# EasyEDA Pro project firefly_rp2354A.eprj, board PCB1
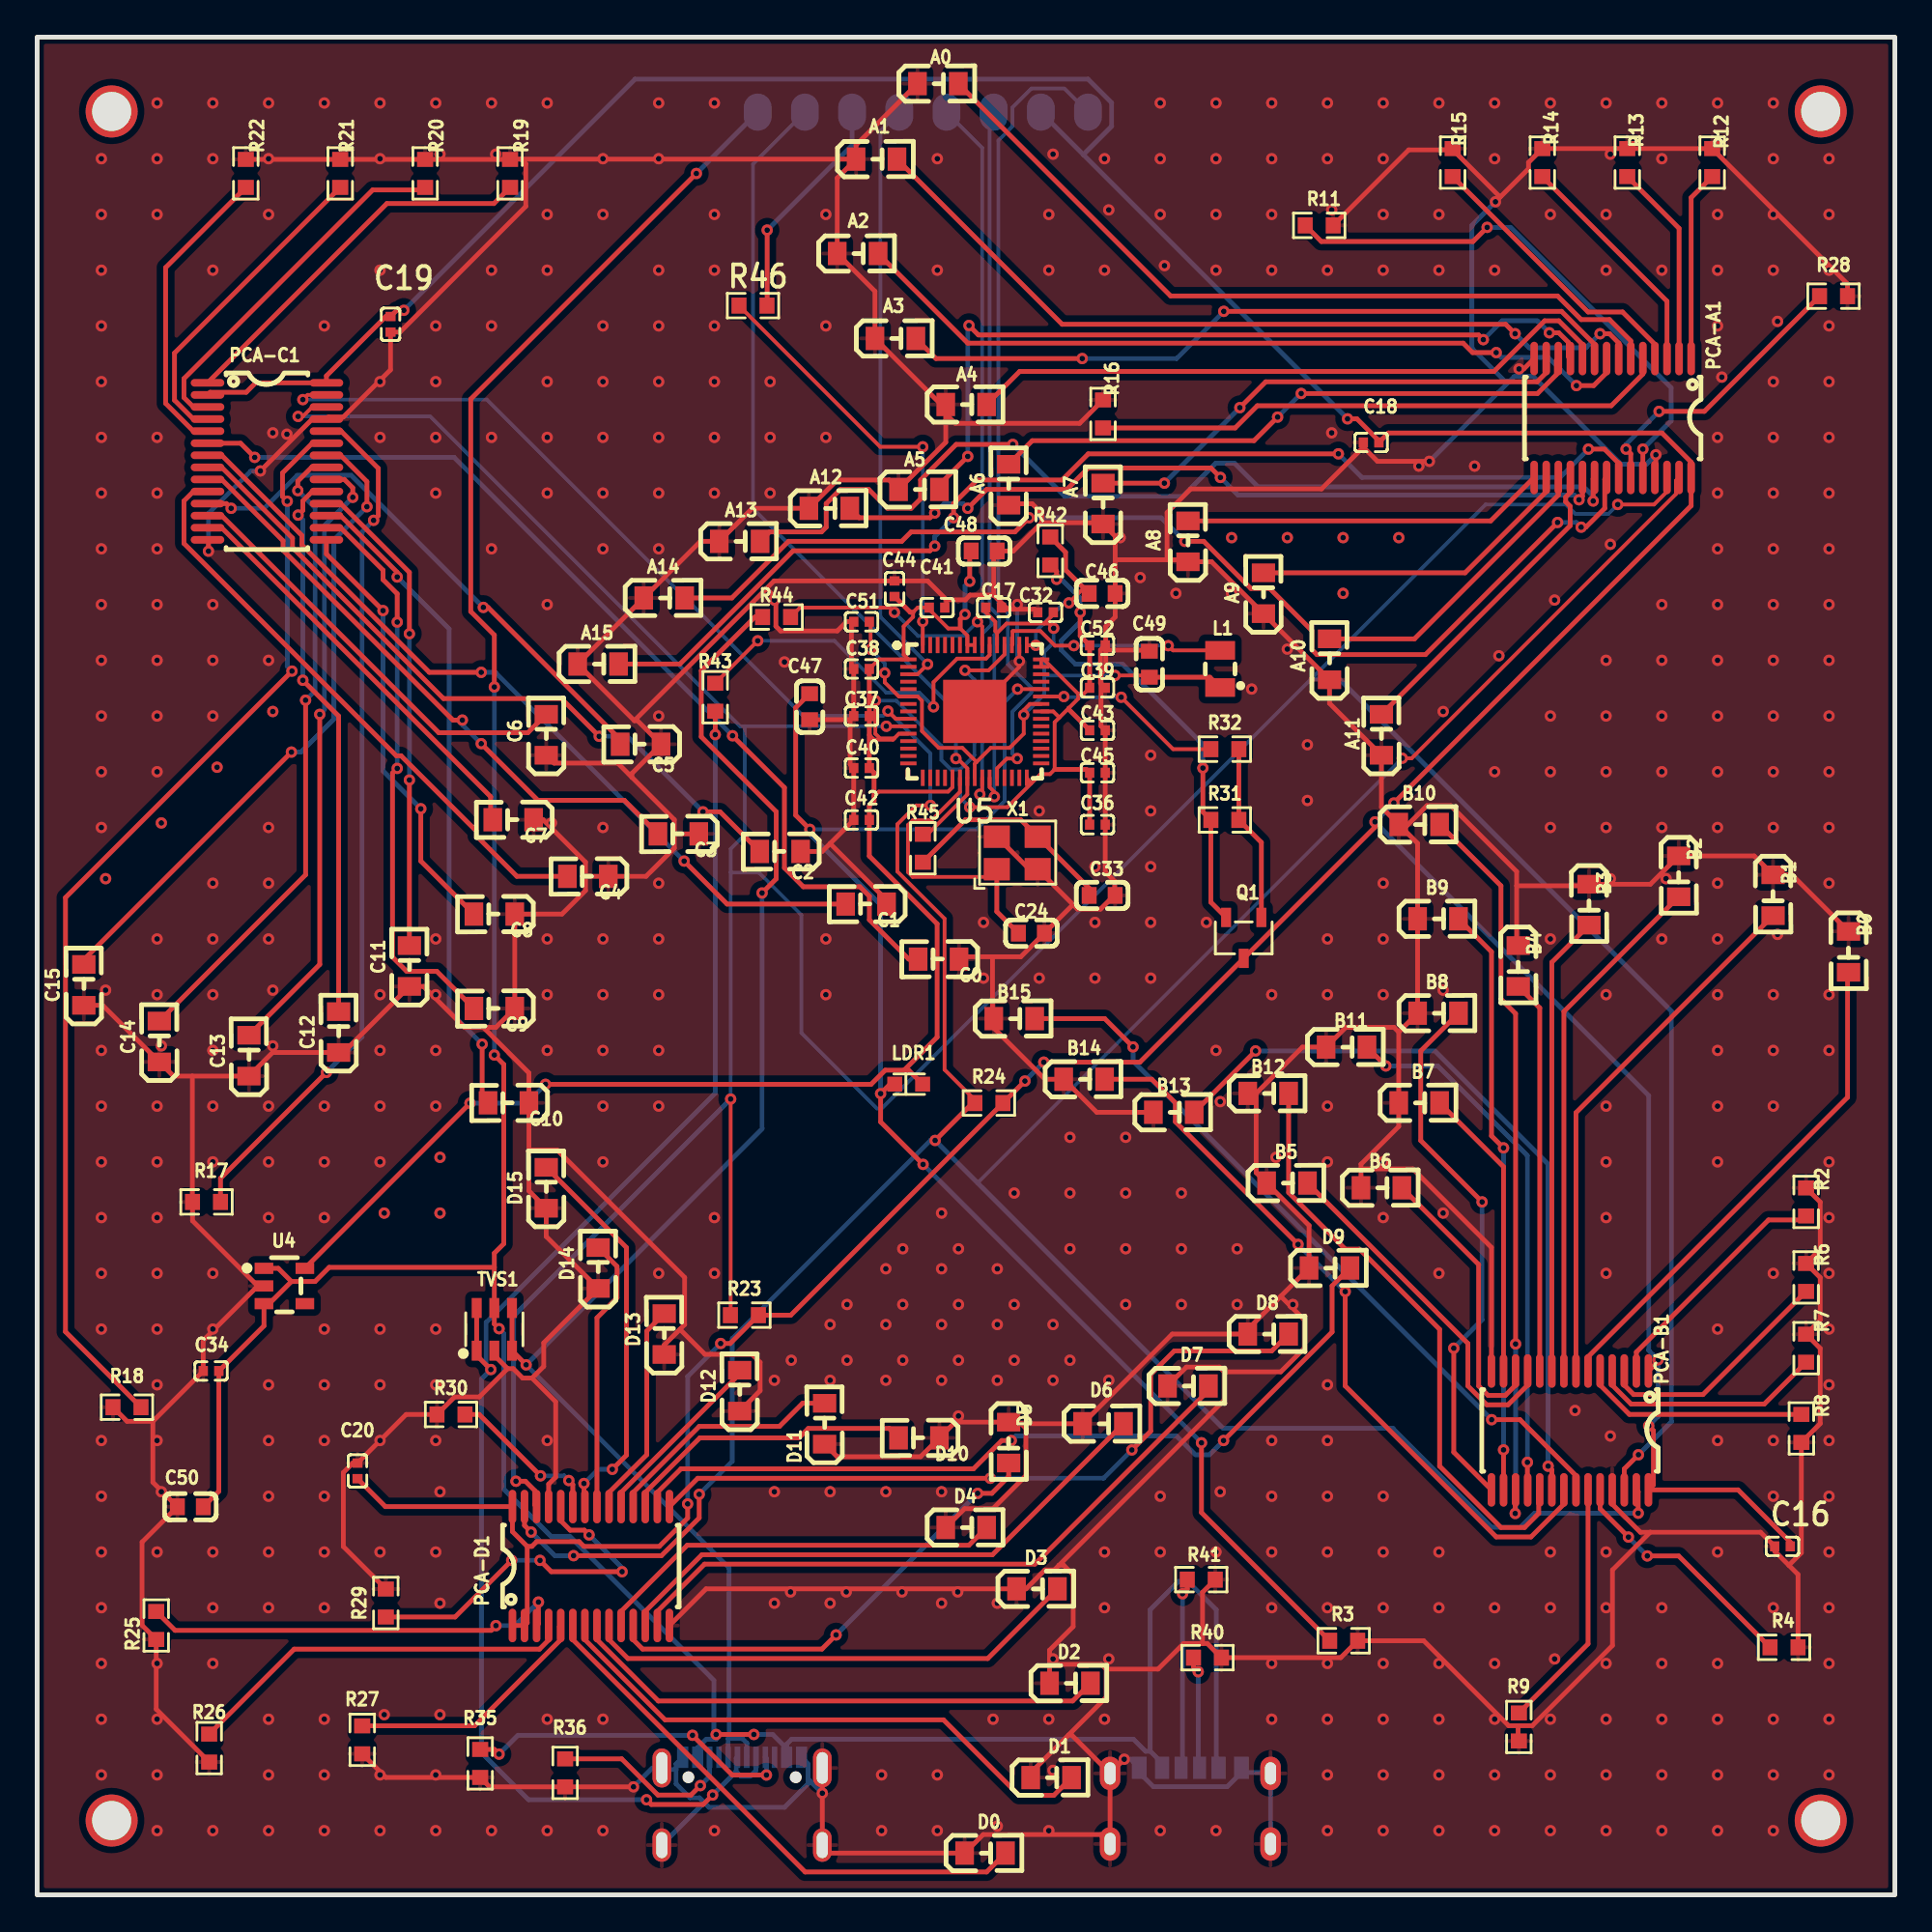
[diagram p2: board, top side]
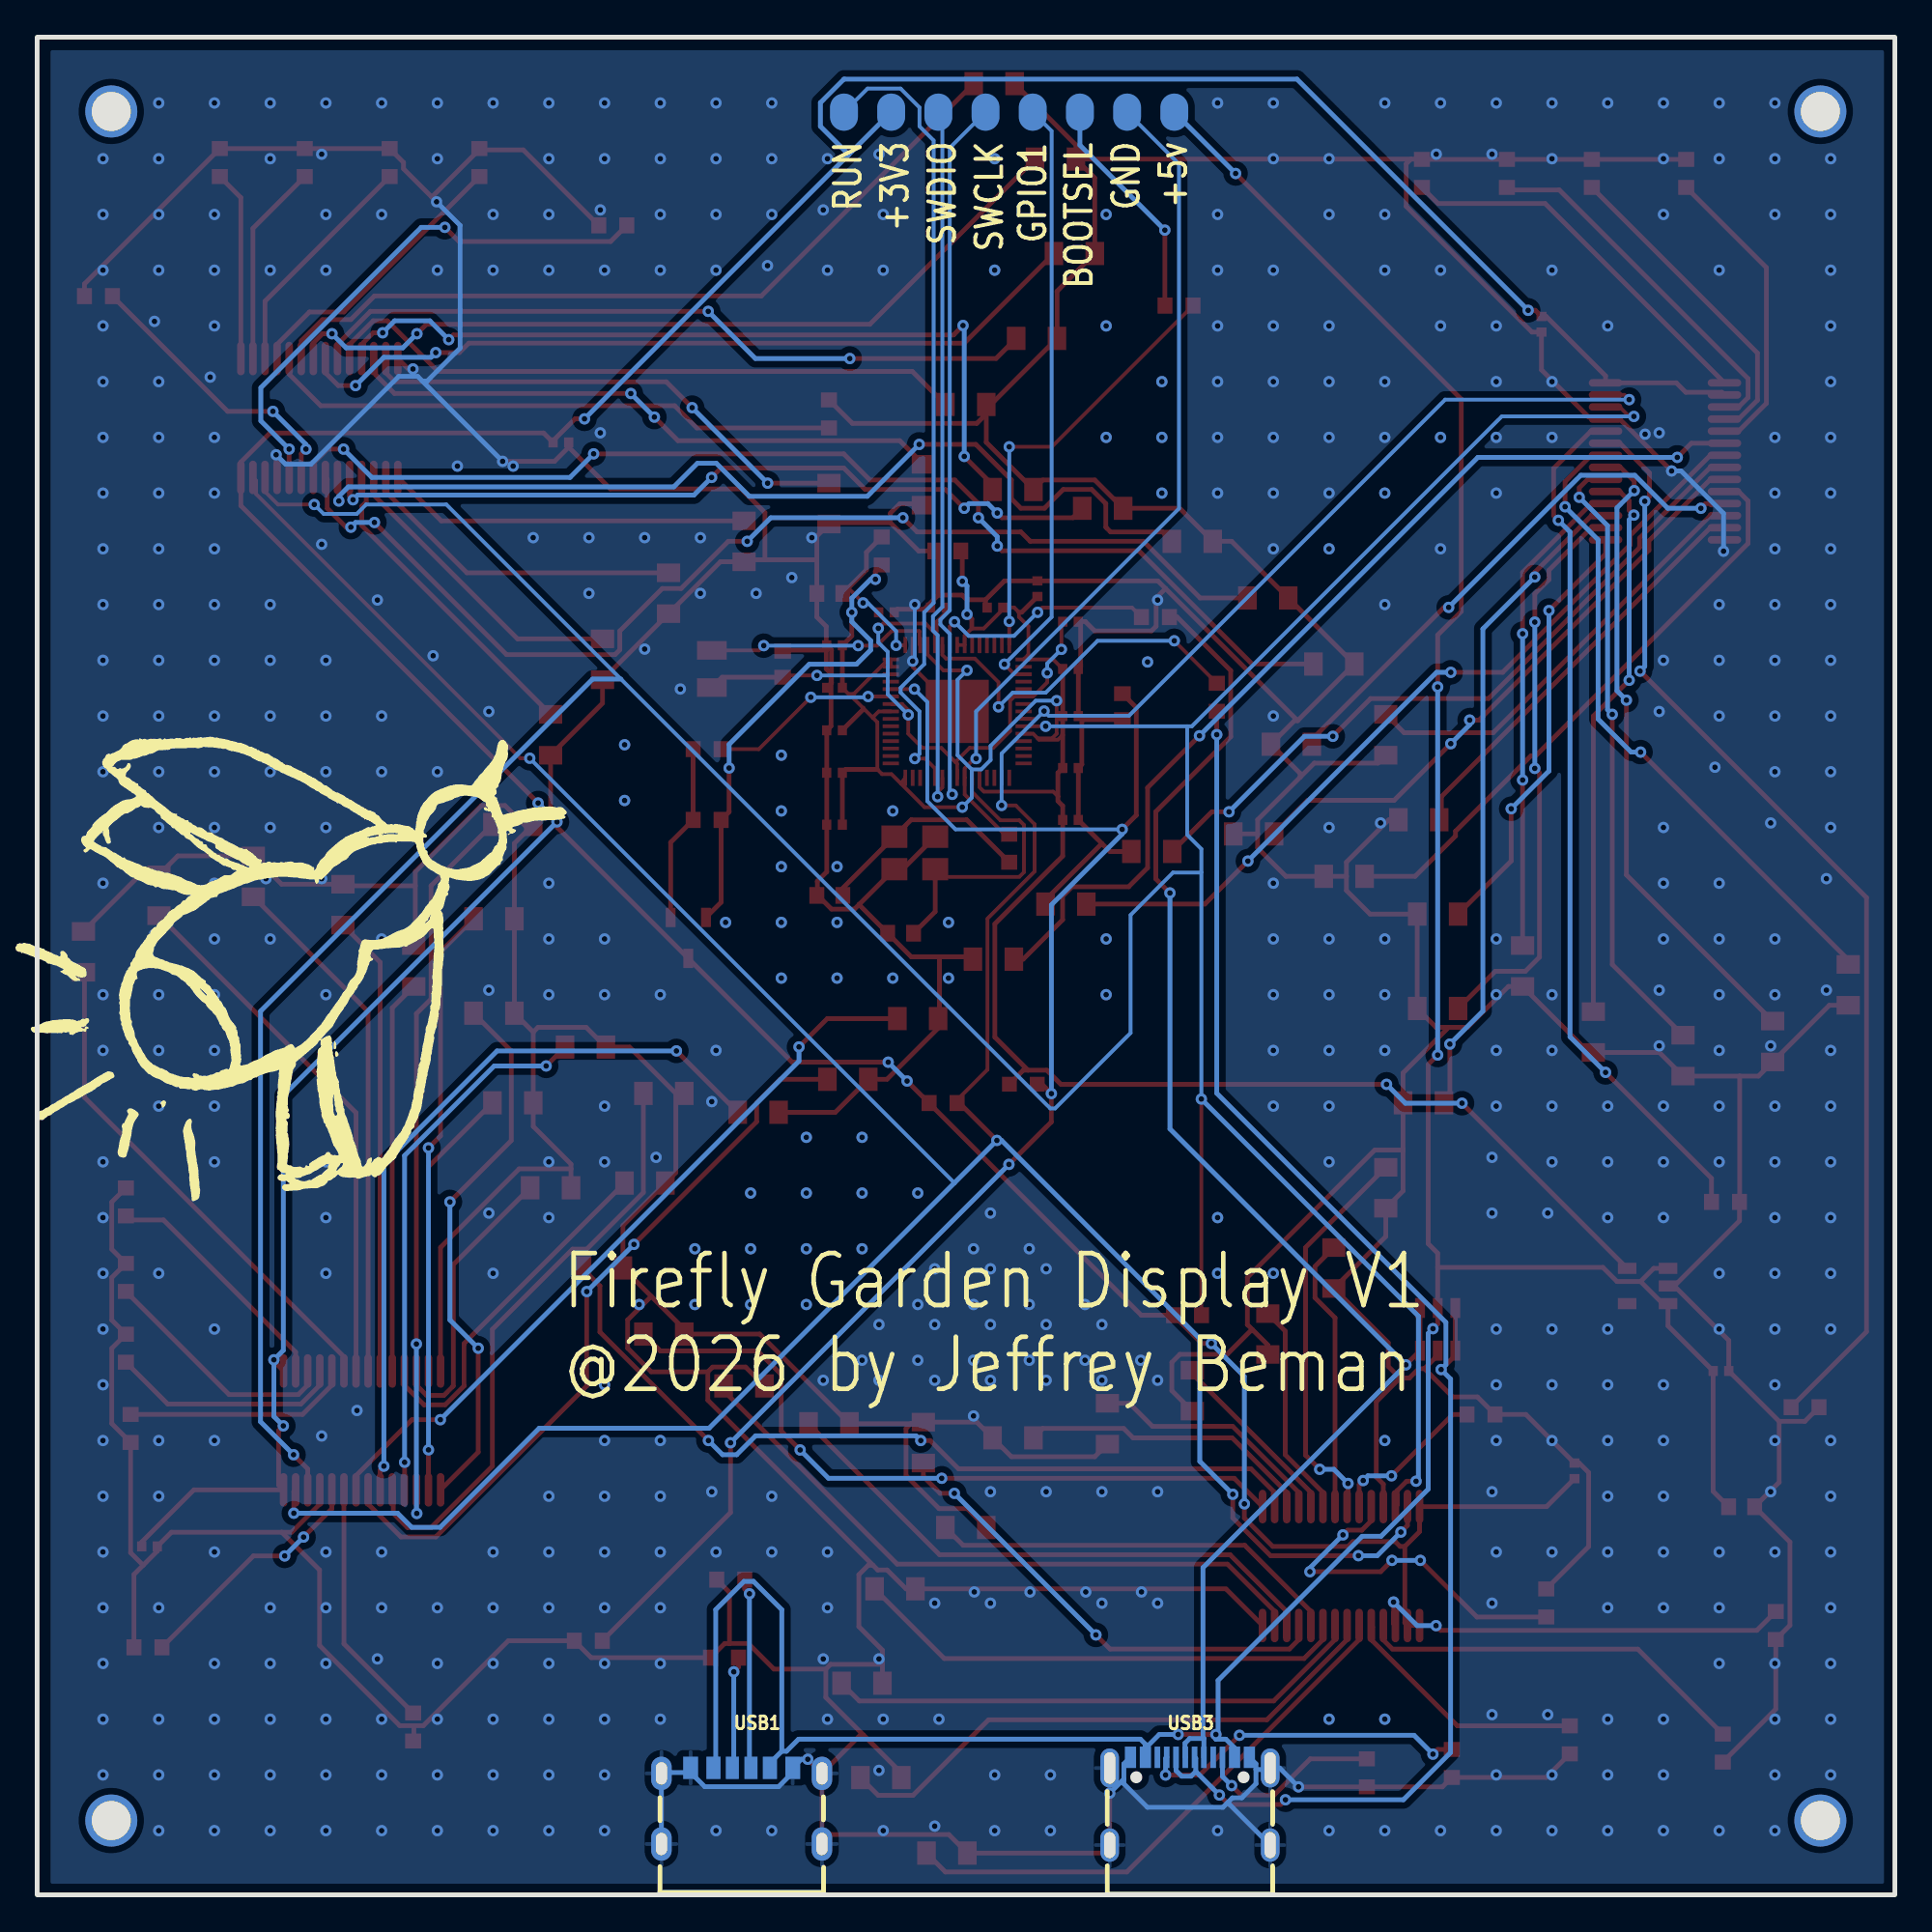
[diagram p3: board, bottom side, seen from below]

Outline 100 x 100 mm; copper layers: Top Layer, Bottom Layer. Coordinates in mm from the lower left corner of the outline.
Outline path: rectangle 0,100 100,0
Stack: Top Layer 0.035mm / Dielectric1 1.51mm FR4 er 4.5 / Bottom Layer 0.035mm

## Design rules (mm)
template: JLCPCB Capability(Two Layers Board)
spacing copperThickness1oz (default): track to track 0.102, other pairs 0.152 to 0.3
spacing copperThickness2oz: track to track 0.203, other pairs 0.152 to 0.3
track width copperThickness1oz (default): min 0.127, default 0.254, max 2.54
track width copperThickness2oz: min 0.203, default 0.254, max 2.54
differential pair differentialPair (default): width min 0.127, default 0.254, max 2.54; gap min 0.152, default 0.152
via viaSize (default): diameter min 0.5, default 0.61, max 10; hole min 0.3, default 0.305, max 6.3

## Placement (name value [footprint] x y rotation side)
A0  XL-2012WWC  [LED0805-RD_WHITE]  48.49 97.5 0 top
A1  XL-2012WWC  [LED0805-RD_WHITE]  45.18 93.43 0 top
A2  XL-2012WWC  [LED0805-RD_WHITE]  44.17 88.35 0 top
A3  XL-2012WWC  [LED0805-RD_WHITE]  46.2 83.78 0 top
A4  XL-2012WWC  [LED0805-RD_WHITE]  50.01 80.23 0 top
A5  XL-2012WWC  [LED0805-RD_WHITE]  47.47 75.65 0 top
A6  XL-2012WWC  [LED0805-RD_WHITE]  52.3 75.91 90 top
A7  XL-2012WWC  [LED0805-RD_WHITE]  57.38 74.89 90 top
A8  XL-2012WWC  [LED0805-RD_WHITE]  61.95 72.86 90 top
A9  XL-2012WWC  [LED0805-RD_WHITE]  66.01 70.07 90 top
A10  XL-2012WWC  [LED0805-RD_WHITE]  69.57 66.51 90 top
A11  XL-2012WWC  [LED0805-RD_WHITE]  72.36 62.45 90 top
A12  XL-2012WWC  [LED0805-RD_WHITE]  42.64 74.64 0 top
A13  XL-2012WWC  [LED0805-RD_WHITE]  37.82 72.86 0 top
A14  XL-2012WWC  [LED0805-RD_WHITE]  33.75 69.81 0 top
A15  XL-2012WWC  [LED0805-RD_WHITE]  30.2 66.26 0 top
B0  XL-2012WWC  [LED0805-RD_WHITE]  97.51 50.76 270 top
B1  XL-2012WWC  [LED0805-RD_WHITE]  93.44 53.81 270 top
B2  XL-2012WWC  [LED0805-RD_WHITE]  88.36 54.83 270 top
B3  XL-2012WWC  [LED0805-RD_WHITE]  83.54 53.3 270 top
B4  XL-2012WWC  [LED0805-RD_WHITE]  79.73 50 270 top
B5  XL-2012WWC  [LED0805-RD_WHITE]  67.28 38.32 0 top
B6  XL-2012WWC  [LED0805-RD_WHITE]  72.36 38.06 0 top
B7  XL-2012WWC  [LED0805-RD_WHITE]  74.39 42.63 0 top
B8  XL-2012WWC  [LED0805-RD_WHITE]  75.41 47.46 0 top
B9  XL-2012WWC  [LED0805-RD_WHITE]  75.41 52.54 0 top
B10  XL-2012WWC  [LED0805-RD_WHITE]  74.39 57.62 0 top
B11  XL-2012WWC  [LED0805-RD_WHITE]  70.48 45.64 0 top
B12  XL-2012WWC  [LED0805-RD_WHITE]  66.27 43.14 0 top
B13  XL-2012WWC  [LED0805-RD_WHITE]  61.19 42.13 0 top
B14  XL-2012WWC  [LED0805-RD_WHITE]  56.36 43.9 0 top
B15  XL-2012WWC  [LED0805-RD_WHITE]  52.6 47.17 0 top
C0  XL-2012WWC  [LED0805-RD_WHITE]  48.52 50.37 180 top
C1  XL-2012WWC  [LED0805-RD_WHITE]  44.62 53.33 180 top
C2  XL-2012WWC  [LED0805-RD_WHITE]  40 56.17 180 top
C3  XL-2012WWC  [LED0805-RD_WHITE]  34.52 57.11 180 top
C4  XL-2012WWC  [LED0805-RD_WHITE]  29.64 54.83 180 top
C5  XL-2012WWC  [LED0805-RD_WHITE]  32.48 61.94 180 top
C6  XL-2012WWC  [LED0805-RD_WHITE]  27.4 62.45 90 top
C7  XL-2012WWC  [LED0805-RD_WHITE]  25.63 57.87 180 top
C8  XL-2012WWC  [LED0805-RD_WHITE]  24.61 52.79 180 top
C9  XL-2012WWC  [LED0805-RD_WHITE]  24.61 47.71 180 top
C10  XL-2012WWC  [LED0805-RD_WHITE]  25.37 42.63 180 top
C11  XL-2012WWC  [LED0805-RD_WHITE]  20.04 50 90 top
C12  XL-2012WWC  [LED0805-RD_WHITE]  16.23 46.44 90 top
C13  XL-2012WWC  [LED0805-RD_WHITE]  11.4 45.17 90 top
C14  XL-2012WWC  [LED0805-RD_WHITE]  6.58 45.94 90 top
C15  XL-2012WWC  [LED0805-RD_WHITE]  2.51 48.98 90 top
C16  100nF  [C0402]  93.95 18.76 0 top
C17  100nF  [C0402]  51.49 69.29 180 top
C18  100nF  [C0402]  71.81 78.18 0 top
C19  100nF  [C0402]  19.02 84.54 90 top
C20  100nF  [C0402]  17.24 22.82 270 top
C24  12pF  [C0603]  53.52 51.77 180 top
C32  100nF  [C0402]  54.28 69.04 0 top
C33  12pF  [C0603]  57.33 53.8 0 top
C34  100nF  [C0402]  9.36 28.2 0 top
C36  100nF  [C0402]  57.08 57.61 180 top
C37  100nF  [C0402]  44.38 63.45 0 top
C38  100nF  [C0402]  44.38 65.99 0 top
C39  100nF  [C0402]  57.08 64.97 180 top
C40  100nF  [C0402]  44.38 60.66 0 top
C41  100nF  [C0402]  48.44 69.29 180 top
C42  100nF  [C0402]  44.38 57.86 0 top
C43  100nF  [C0402]  57.08 62.69 180 top
C44  100nF  [C0402]  46.15 70.31 270 top
C45  100nF  [C0402]  57.08 60.4 180 top
C46  4.7uF  [C0603]  57.33 70.05 0 top
C47  10nF  [C0603]  41.58 63.96 270 top
C48  4.7uF  [C0603]  50.98 72.34 180 top
C49  4.7uF  [C0603]  59.87 66.24 90 top
C50  4.7uF  [C0603]  8.25 20.89 180 top
C51  100nF  [C0402]  44.38 68.53 0 top
C52  100nF  [C0402]  57.08 67.26 0 top
D0  XL-2012WWC  [LED0805-RD_WHITE]  51.03 2.25 0 top
D1  XL-2012WWC  [LED0805-RD_WHITE]  54.58 6.31 0 top
D2  XL-2012WWC  [LED0805-RD_WHITE]  55.6 11.39 0 top
D3  XL-2012WWC  [LED0805-RD_WHITE]  53.82 16.47 0 top
D4  XL-2012WWC  [LED0805-RD_WHITE]  50.01 19.77 0 top
D5  XL-2012WWC  [LED0805-RD_WHITE]  52.3 24.35 270 top
D6  XL-2012WWC  [LED0805-RD_WHITE]  57.38 25.36 0 top
D7  XL-2012WWC  [LED0805-RD_WHITE]  61.95 27.39 0 top
D8  XL-2012WWC  [LED0805-RD_WHITE]  66.27 30.19 0 top
D9  XL-2012WWC  [LED0805-RD_WHITE]  69.57 33.74 0 top
D10  XL-2012WWC  [LED0805-RD_WHITE]  47.47 24.6 180 top
D11  XL-2012WWC  [LED0805-RD_WHITE]  42.39 25.36 90 top
D12  XL-2012WWC  [LED0805-RD_WHITE]  37.82 27.14 90 top
D13  XL-2012WWC  [LED0805-RD_WHITE]  33.75 30.19 90 top
D14  XL-2012WWC  [LED0805-RD_WHITE]  30.2 33.74 90 top
D15  XL-2012WWC  [LED0805-RD_WHITE]  27.4 38.06 90 top
L1  AOTA-B201610S3R3-101-T  [IND-SMD_L2.0-W1.6_AOTA-B201610S3R3-101-T]  63.68 65.99 270 top
LDR1  ALS-PT19-315C/L177/TR8  [SENSORS-SMD_ALS-PT19]  46.92 43.64 180 top
NOREF  -  [Pad_e1738]  41.33 95.96 180 top
NOREF#2  -  [Pad_e1742]  54.03 95.96 0 top
NOREF#3  -  [Pad_e1731]  4.01 96 0 top
NOREF#4  -  [Pad_e1733]  96.01 4 0 top
NOREF#5  -  [Pad_e1741]  51.49 95.96 90 top
NOREF#6  -  [Pad_e1734]  96.01 96 0 top
NOREF#7  -  [Pad_e1740]  48.95 95.96 90 top
NOREF#8  -  [Pad_e1732]  4.01 4 0 top
NOREF#9  -  [Pad_e1743]  56.57 95.96 90 top
NOREF#10  -  [Pad_e45307]  43.87 95.96 0 top
NOREF#11  -  [Pad_e1739]  46.41 95.96 0 top
NOREF#12  -  [Pad_e1737]  38.79 95.96 0 top
PCA-A1  PCA9685PW,118  [TSSOP-28_L9.7-W4.4-P0.65-LS6.4-TL]  84.81 79.5 270 top
PCA-B1  PCA9685PW,118  [TSSOP-28_L9.7-W4.4-P0.65-LS6.4-TL]  82.51 25 270 top
PCA-C1  PCA9685PW,118  [TSSOP-28_L9.7-W4.4-P0.65-LS6.4-TL]  12.37 77.17 0 top
PCA-D1  PCA9685PW,118  [TSSOP-28_L9.7-W4.4-P0.65-LS6.4-TL]  29.81 17.7 90 top
Q1  FDN340P  [SOT-23-3_L3.0-W1.7-P0.95-LS2.9-BR]  64.95 51.51 90 top
R2  10kΩ  [R0603]  95.22 37.3 270 top
R3  47kΩ  [R0603]  70.33 13.68 0 top
R4  10kΩ  [R0603]  94.03 13.32 0 top
R6  10kΩ  [R0603]  95.22 33.24 270 top
R7  10kΩ  [R0603]  95.22 29.43 270 top
R8  10kΩ  [R0603]  94.97 25.11 90 top
R9  10kΩ  [R0603]  79.76 9.03 270 top
R11  10kΩ  [R0603]  69.01 89.87 0 top
R12  10kΩ  [R0603]  90.17 93.25 270 top
R13  10kΩ  [R0603]  85.6 93.25 270 top
R14  10kΩ  [R0603]  81.02 93.25 270 top
R15  10kΩ  [R0603]  76.2 93.25 270 top
R16  10kΩ  [R0603]  57.38 79.72 270 top
R17  10kΩ  [R0603]  9.12 37.3 180 top
R18  10kΩ  [R0603]  4.83 26.25 180 top
R19  10kΩ  [R0603]  25.46 92.67 270 top
R20  10kΩ  [R0603]  20.88 92.67 270 top
R21  10kΩ  [R0603]  16.31 92.67 270 top
R22  10kΩ  [R0603]  11.23 92.67 270 top
R23  4.7kΩ  [R0603]  38.07 31.2 180 top
R24  4.7kΩ  [R0603]  51.23 42.62 180 top
R25  10kΩ  [R0603]  6.41 14.5 90 top
R26  10kΩ  [R0603]  9.26 7.9 90 top
R27  10kΩ  [R0603]  17.5 8.34 90 top
R28  10kΩ  [R0603]  96.7 86.06 0 top
R29  10kΩ  [R0603]  18.77 15.71 90 top
R30  10kΩ  [R0603]  22.28 25.86 180 top
R31  100kΩ  [R0603]  63.93 57.86 180 top
R32  220Ω  [R0603]  63.93 61.67 180 top
R35  5.1kΩ  [R0603]  23.85 7.07 270 top
R36  5.1kΩ  [R0603]  28.42 6.57 270 top
R40  5.1kΩ  [R0603]  63 12.77 0 top
R41  5.1kΩ  [R0603]  62.66 16.97 0 top
R42  33Ω  [R0603]  54.54 72.34 270 top
R43  33Ω  [R0603]  36.5 64.47 90 top
R44  33Ω  [R0603]  39.8 68.78 0 top
R45  1kΩ  [R0603]  47.68 56.34 90 top
R46  1kΩ  [R0603]  38.53 85.55 0 top
TVS1  USBLC6-2SC6  [SOT-23-6_L2.9-W1.6-P0.95-LS2.8-BL]  24.61 30.44 0 top
U4  AP2112K-3.3TRG1  [SOT-23-5_L2.9-W1.6-P0.95-LS2.8-BR]  13.31 32.77 180 top
U5  RP2354A  [QFN-60_L7.0-W7.0-P0.40-TL-EP3.4]  50.47 63.7 0 top
USB1  USB-312-B-SU  [USB-C-SMD_10P-P1.00-L6.8-W8.9]  62.07 4.79 180 bottom
USB3  TYPE-C16PIN  [USB-C-SMD_TYPE-C16PIN]  37.94 5.04 180 bottom
X1  12MHz  [OSC-SMD_4P-L3.2-W2.5-BL]  52.76 56.08 0 top

## Footprints (pads in the part's own frame, mm; a bottom-side part is the same pattern mirrored in y, then rotated)
C0402
  rect 0.5x0.54 smd: 1(-0.42,0) 2(0.42,0)
C0603
  rect 0.8x0.9 smd: 1(-0.7,0) 2(0.7,0)
IND-SMD_L2.0-W1.6_AOTA-B201610S3R3-101-T
  rect 1x1.6 smd: 1(-1,0) 2(1,0)
LED0805-RD_WHITE
  rect 1x1.25 smd: 1(-1.1,0) 2(1.1,0)
OSC-SMD_4P-L3.2-W2.5-BL
  rect 1.4x1.2 smd: 1(-1.1,-0.875) 2(1.1,-0.875) 3(1.1,0.875) 4(-1.1,0.875)
Pad_e1731
  round 2.8 hole 2.1: 1(0,0)
Pad_e1732
  round 2.8 hole 2.1: 3(0,0)
Pad_e1733
  round 2.8 hole 2.1: 4(0,0)
Pad_e1734
  round 2.8 hole 2.1: 2(0,0)
Pad_e1737
  oval 1.5x2 smd far side: 1(0,0)
Pad_e1738
  oval 1.5x2 smd far side: 3(0,0)
Pad_e1739
  oval 1.5x2 smd far side: 1(0,0)
Pad_e1740
  oval 2x1.5 smd far side: 7(0,0)
Pad_e1741
  oval 2x1.5 smd far side: 6(0,0)
Pad_e1742
  oval 1.5x2 smd far side: 2(0,0)
Pad_e1743
  oval 2x1.5 smd far side: 5(0,0)
Pad_e45307
  oval 1.5x2 smd far side: 10(0,0)
QFN-60_L7.0-W7.0-P0.40-TL-EP3.4
  rect 0.875x0.2 smd: 1(-3.575,2.8) 2(-3.575,2.4) 3(-3.575,2) 4(-3.575,1.6) 5(-3.575,1.2) 6(-3.575,0.8) 7(-3.575,0.4) 8(-3.575,0) 9(-3.575,-0.4) 10(-3.575,-0.8) 11(-3.575,-1.2) 12(-3.575,-1.6) 13(-3.575,-2) 14(-3.575,-2.4) 15(-3.575,-2.8) 31(3.575,-2.8) 32(3.575,-2.4) 33(3.575,-2.001) 34(3.575,-1.6) 35(3.575,-1.2) 36(3.575,-0.8) 37(3.575,-0.4) 38(3.575,-0.001) 39(3.575,0.4) 40(3.575,0.8) 41(3.575,1.2) 42(3.575,1.6) 43(3.575,2) 44(3.575,2.4) 45(3.575,2.8)
  rect 0.2x0.875 smd: 16(-2.8,-3.575) 17(-2.4,-3.575) 18(-2,-3.575) 19(-1.6,-3.575) 20(-1.2,-3.575) 21(-0.8,-3.575) 22(-0.4,-3.575) 23(0,-3.575) 24(0.4,-3.575) 25(0.8,-3.575) 26(1.2,-3.575) 27(1.6,-3.575) 28(2,-3.575) 29(2.4,-3.575) 30(2.8,-3.575) 46(2.8,3.575) 47(2.4,3.575) 48(2,3.575) 49(1.6,3.575) 50(1.2,3.575) 51(0.8,3.575) 52(0.4,3.575) 53(0,3.575) 54(-0.4,3.575) 55(-0.8,3.575) 56(-1.2,3.575) 57(-1.6,3.575) 58(-2,3.575) 59(-2.4,3.575) 60(-2.8,3.575)
  rect 3.4x3.4 smd: 61(0,0)
R0603
  rect 0.806x0.864 smd: 1(-0.753,0) 2(0.753,0)
SENSORS-SMD_ALS-PT19
  rect 0.8x0.8 smd: 1(-0.75,0) 2(0.75,0)
SOT-23-3_L3.0-W1.7-P0.95-LS2.9-BR
  rect 1.038x0.532 smd: 1(1.101,-0.95) 2(1.101,0.95) 3(-1.101,0)
SOT-23-5_L2.9-W1.6-P0.95-LS2.8-BR
  rect 1x0.6 smd: 1(1.1,-0.95) 2(1.1,0) 3(1.1,0.95) 4(-1.1,0.95) 5(-1.1,-0.95)
SOT-23-6_L2.9-W1.6-P0.95-LS2.8-BL
  rect 0.532x1.072 smd: 1(-0.95,-1.149) 2(0,-1.149) 3(0.95,-1.149) 4(0.95,1.149) 5(0,1.149) 6(-0.95,1.149)
TSSOP-28_L9.7-W4.4-P0.65-LS6.4-TL
  oval 1.804x0.406 smd: 1(-3.2,4.225) 2(-3.2,3.575) 3(-3.2,2.925) 4(-3.2,2.275) 5(-3.2,1.625) 6(-3.2,0.975) 7(-3.2,0.325) 8(-3.2,-0.325) 9(-3.2,-0.975) 10(-3.2,-1.625) 11(-3.2,-2.275) 12(-3.2,-2.925) 13(-3.2,-3.575) 14(-3.2,-4.225) 15(3.2,-4.225) 16(3.2,-3.575) 17(3.2,-2.925) 18(3.2,-2.275) 19(3.2,-1.625) 20(3.2,-0.975) 21(3.2,-0.325) 22(3.2,0.325) 23(3.2,0.975) 24(3.2,1.625) 25(3.2,2.275) 26(3.2,2.925) 27(3.2,3.575) 28(3.2,4.225)
USB-C-SMD_10P-P1.00-L6.8-W8.9
  oval 1.1x1.8 hole 0.6x1.2: 0(-4.32,-2.05) 0(-4.32,1.75) 0(4.32,-2.05) 0(4.32,1.75)
  rect 0.8x1.2 smd: 1(-2.749,2.05) 6(2.749,2.05)
  rect 0.76x1.2 smd: 2(-1.52,2.05) 5(1.52,2.05)
  rect 0.7x1.2 smd: 3(-0.5,2.05) 4(0.5,2.05)
USB-C-SMD_TYPE-C16PIN
  oval 1x2.1 hole 0.6x1.7: 1(-4.32,1.788) 2(4.32,1.788)
  oval 1x1.8 hole 0.6x1.4: 3(-4.32,-2.362) 4(4.32,-2.362)
  rect 0.6x1.15 smd: A1B12(-3.2,2.362) A4B9(-2.4,2.362) B1A12(3.2,2.362) B4A9(2.4,2.362)
  rect 0.3x1.15 smd: A5(-1.25,2.362) A6(-0.25,2.362) A7(0.25,2.362) A8(1.25,2.362) B5(1.75,2.362) B6(0.75,2.362) B7(-0.75,2.362) B8(-1.75,2.362)

## Nets
As in the schematic, except:
3V3_SW: C16.2 C18.2 C19.2 C20.2 NOREF#2.2 PCA-A1.28 PCA-B1.1 PCA-B1.28 PCA-C1.2 PCA-C1.28 PCA-D1.1 PCA-D1.2 PCA-D1.28 Q1.3 R23.1 R24.1
+5V_USB: C34.2 C50.1 NOREF#12.1 TVS1.5 U4.1 U4.3 USB1.2 USB1.5 USB3.A4B9 USB3.B4A9
GPIO1: NOREF#11.1 U5.3
QSPI_SS: NOREF#10.10 R46.2
RUN: NOREF#9.5 U5.26
SWCLK: NOREF#7.7 U5.24
SWD: NOREF#5.6 U5.25
XOUT: NOREF.3 R45.2 U5.22

Pads without a net: NOREF#3 1; NOREF#4 4; NOREF#6 2; NOREF#8 3; U4 4; U5 2 4 5 7 8 12 13 14 15 16 17 18 19 27 28 29 31 32 33 34 35 36 37 42 43 55 56 57 58 59; USB3 A8 B8

## Via types
v1: diameter 0.61, hole 0.305, Top Layer to Bottom Layer, 726 vias

## Routing (per net, layer and track width the routed paths; a pad name or vN(x,y) marks a point on that pad's centre or on a via; arc(x,y) is an arc through that point)
3V3_SW: length 265.2
  Top Layer w0.254: v1(72.02,57.76) 72.02,57.48 Q1.3 59.36,44.82 v1(54.19,44.82) ; v1(53.17,43.81) R24.1 40.57,31.2 R23.1 37.3,29.68 v1(36.79,29.68) ; 17.24,22.4 18.75,20.9 25.58,20.9 25.58,19.55 26.38,18.76 ; PCA-D1.1 26.23,14.5 26.38,14.64 26.38,18.76 ; 26.38,18.76 26.63,18.76 26.89,19.01 29.17,19.01 29.43,18.76 33.49,18.76 35.02,20.28 v1(35.02,21.04) ; 86.74,28.2 87.26,28.72 v1(87.26,28.8) ; v1(70.54,79.45) 71.05,79.45 72.23,78.27 C18.2 72.74,78.69 87.47,78.69 89.03,77.12 PCA-A1.28 89.03,74.78 v1(73.03,58.77) ; PCA-C1.2 9.31,80.88 11.25,80.88 11.76,81.39 PCA-C1.28 15.57,81.77 18.77,84.96 C19.2 19.35,85.3 v1(19.74,85.3) ; v1(86.75,25.25) 87,24.99 87,22.07 86.73,21.8 91.56,21.8 94.37,18.99 C16.2
  Bottom Layer w0.254: 56.31,93.68 57.84,95.2 57.84,96.47 56.57,97.74 32.18,97.74 v1(19.74,85.3) ; 56.31,93.68 v1(70.54,79.45) ; 56.31,93.68 NOREF#2.2 ; v1(35.02,21.04) 35.02,27.9 v1(36.79,29.68) ; v1(86.75,25.25) 87.26,25.75 v1(87.26,28.8) 86.75,29.31 86.75,43.03 v1(72.02,57.76) v1(73.03,58.77) ; v1(54.19,44.82) v1(53.17,43.81)
+1V: length 39.2
  Top Layer w0.2: v1(44.87,67.05) 44.87,68.46 C51.2 ; C49.1 59.77,65.64 v1(58.02,65.64) ; 54.21,68.43 54.47,68.43 v1(54.72,68.18) ; 54.21,68.43 52.18,68.43 51.67,67.93 ; 54.21,68.43 54.7,68.92 C32.2 ; 51.67,67.93 51.58,68.02 51.58,68.53 51.07,69.04 C17.2 ; 51.67,67.93 U5.50 ; U5.39 53.44,64.1 53.11,63.77 v1(53.11,63.52) 53.11,62.5 52.35,61.74 51.33,61.74 50.57,60.98 ; 50.57,60.98 50.47,60.88 U5.23 ; 50.57,60.98 49.81,61.74 48.54,61.74 47.63,62.65 47.63,64.28 47.41,64.5 U5.6 46.39,64.5 45.63,65.27 v1(45.63,65.77)
  Top Layer w0.254: L1.2 63.13,65.55 C49.1
  Bottom Layer w0.2: v1(53.11,63.52) 54.21,64.62 54.21,65.64 ; 54.21,65.64 v1(58.02,65.64) ; 54.21,65.64 54.21,66.91 54.72,67.42 v1(54.72,68.18) ; v1(45.63,65.77) 45.63,66.28 v1(44.87,67.05)
+3V3: length 156.9
  Top Layer w0.2: 45.05,59.13 45.3,59.39 49.04,59.39 49.27,59.62 U5.20 ; 47.91,69.3 47.41,69.3 47.15,69.05 47.15,68.79 46.64,68.28 46.64,66.76 U5.1 45.31,66.5 C38.2 ; 47.91,69.3 C41.2 ; 47.91,69.3 49.04,68.17 49.69,68.17 50.07,67.79 U5.54 U5.53 ; v1(49.95,65.92) 51.22,65.92 52.07,66.77 U5.49 ; v1(50.2,58.55) 52.23,58.55 53.5,59.82 ; v1(45.12,64.28) 45.12,62.5 45.37,62.25 46.14,62.25 ; 46.14,62.25 46.07,62.18 45.05,62.18 44.8,62.43 ; 46.14,62.25 46.39,62.5 U5.11 ; 56.04,64.65 56.33,64.65 C39.2 ; 56.04,64.65 54.18,66.5 U5.45 U5.44 ; 56.04,64.65 56.04,64.39 55.03,63.38 ; 53.5,59.82 U5.30 ; 53.5,59.82 54.01,60.33 54.52,60.33 54.77,60.58 54.77,63.12 55.03,63.38 ; 55.03,63.38 54.7,63.7 U5.38
  Top Layer w0.254: v1(50.2,70.71) 50.2,72.26 C48.2 ; C36.2 C45.2 56.48,60.58 54.77,60.58 ; v1(27.36,43.63) 44.89,43.63 45.65,44.39 46.67,44.39 ; R42.2 54.88,71.25 v1(54.88,70.82) ; 46.67,44.39 46.91,44.39 LDR1.1 ; 46.67,44.39 48.45,46.17 48.45,52.27 44.8,55.92 C42.2 44.8,58.62 45.05,58.88 45.05,60.4 C40.2 C37.2 C38.2 ; Q1.2 63.18,53.43 R31.2 62.75,58.29 v1(62.75,60.66) ; C44.2 47,69.05 47.15,69.05 ; 49.69,68.17 49.69,68.68 v1(49.94,68.93) ; v1(56.15,69.04) 56.15,67.77 C52.1 C39.2 ; 55.53,63.88 55.53,63.81 C43.2 ; U4.5 v1(23.3,42.61)
  Bottom Layer w0.2: 49.69,60.58 50.45,61.34 50.45,65.41 v1(49.95,65.92) ; 49.69,60.58 49.69,59.06 v1(50.2,58.55) ; 49.69,60.58 49.18,60.58 48.68,61.09 48.68,61.85 46.25,64.28 v1(45.12,64.28)
  Bottom Layer w0.254: v1(49.94,68.93) 49.94,70.45 v1(50.2,70.71) ; v1(23.3,42.61) 26.35,42.61 v1(27.36,43.63) ; v1(54.88,70.82) 55.13,70.82 56.15,69.8 v1(56.15,69.04) 56.15,68.53 55.13,67.52 55.13,67.01 55.89,66.24 58.43,66.24 62.75,61.93 v1(62.75,60.66)
+5V_USB: length 176.6
  Top Layer w0.254: 13.69,33.02 14.96,33.02 15.72,33.78 24.61,33.78 ; 13.69,33.02 12.98,33.72 U4.1 ; 13.69,33.02 12.5,31.82 U4.3 12.21,30.63 C34.2 9.78,21.72 C50.1 ; 24.61,33.78 TVS1.5 24.61,30.73 v1(24.86,30.48) ; 24.61,33.78 24.61,34.54 25.12,35.05 25.12,44.7 v1(24.61,45.21) ; v1(24.61,65.02) 24.61,67.81 23.34,69.08 23.34,80.52 v1(35.49,92.66) ; v1(36.55,8.63) v1(38.58,8.63)
  Bottom Layer w0.254: 36.55,8.38 v1(36.55,8.63) ; 36.55,8.38 36.43,8.5 36.43,11.54 28.67,19.3 27.66,19.3 25.12,21.84 25.12,30.22 v1(24.86,30.48) ; 36.55,8.38 36.01,8.38 35.54,7.91 USB3.B4A9 ; NOREF#12.1 v1(35.49,92.66) ; USB1.5 60.56,7.09 59.92,7.73 ; v1(38.58,8.63) 39.6,8.63 40.36,7.87 ; 59.92,7.73 59.92,15.35 61.44,16.88 61.95,16.88 63.47,15.35 63.47,6.96 63.6,6.84 ; 59.92,7.73 59.66,7.73 59.01,8.38 40.61,8.38 40.36,8.12 40.36,7.87 ; 40.36,7.87 40.36,7.42 USB3.A4B9 ; v1(24.61,65.02) v1(24.61,45.21)
GND: length 901.3
  Top Layer w0.2: 52.76,69.2 v1(52.76,69.46) ; U5.47 v1(52.87,66.41) 52.87,66.1 U5.61
  Top Layer w0.254: D7.1 61.86,28.41 63.64,28.41 63.9,28.16 ; 52.97,25.36 D6.1 61.1,30.19 D8.1 65.17,30.44 66.94,32.22 ; 52.97,25.36 52.38,25.36 52.3,25.45 49.42,25.45 D10.1 47.55,23.58 43.07,23.58 D11.1 ; 52.97,25.36 53.23,25.11 53.23,22.57 51.45,20.79 49.93,20.79 D4.1 ; 34.04,14.5 36.01,16.47 D3.1 53.23,16.47 54.24,17.49 54.75,17.49 55.01,17.74 ; 71.26,39.08 71.26,39.33 73.29,41.36 B7.1 73.29,46.44 ; 71.26,39.08 74.06,39.08 78.28,34.85 78.28,28.2 ; 71.26,39.08 B6.1 ; 94.29,17.74 93.53,18.5 C16.1 92.77,19.52 86.83,19.52 ; 94.29,17.74 94.97,18.42 R8.1 95.98,25.37 95.98,29.42 R7.1 95.98,30.94 95.98,33.23 R6.1 95.98,34.75 95.98,37.29 R2.1 ; 94.29,17.74 94.79,17.25 R4.2 ; v1(78.5,91.14) 78.75,91.39 ; 78.75,91.39 80.28,92.91 80.28,93.25 R14.1 R13.1 R12.1 97.45,86.72 R28.2 ; 78.75,91.39 76.21,93.93 ; v1(32.1,5.81) 28.42,5.81 ; R26.1 6.41,10 R25.1 5.65,14.51 5.65,18.99 C50.2 6.23,22.21 6.23,25.49 ; 42.69,56.59 45.72,53.56 C1.1 ; 42.69,56.59 42.26,56.17 C2.1 ; 42.69,56.59 C42.1 C40.1 43.76,60.85 43.76,63.26 ; R29.2 16.48,18.75 16.48,22.73 16.99,23.24 C20.1 19.86,25.86 R30.2 22.47,26.8 23.8,26.8 25.32,28.33 ; 63.9,28.16 66.94,28.16 68.21,29.43 68.21,30.95 66.94,32.22 ; 63.9,28.16 63.9,26.63 55.01,17.74 ; 43.76,63.26 C47.2 ; 43.76,63.26 C37.1 C38.1 43.83,66.12 43.83,68.54 ; 32.01,60.16 34.3,57.87 34.3,57.11 ; 32.01,60.16 32.01,60.37 C5.1 32.31,63.21 32.15,63.21 ; 32.01,60.16 31.25,60.92 27.83,60.92 C6.1 ; 39.26,70.32 39.67,70.73 C44.1 47.93,70.73 48.95,69.71 ; 39.26,70.32 32.15,63.21 ; 39.26,70.32 39.77,69.81 39.77,68.29 40.02,68.03 43.07,68.03 43.58,68.54 43.83,68.54 ; 73.29,46.44 73.04,46.7 70.45,46.7 B11.1 68.11,45.64 65.62,43.14 ; 73.29,46.44 B8.1 B9.1 74.31,56.6 73.55,57.37 ; 54.5,12.41 54.5,13.17 55.77,14.44 55.77,17.23 55.26,17.74 55.01,17.74 ; 54.5,12.41 D2.1 ; 54.5,12.41 57.29,12.41 57.55,12.15 ; 51.49,69.97 51.49,72.15 C48.1 52.55,72.34 54.07,73.86 ; 51.49,69.97 52,69.46 ; 51.49,69.97 50.22,69.97 49.96,69.71 48.95,69.71 ; 58,53.82 57.24,53.06 56,53.06 55.75,53.32 ; 58,53.82 58,54.56 57.5,55.07 C36.1 C45.1 C43.1 57.27,62.92 57.27,65.2 ; 58,53.82 C33.2 ; 51.43,50.5 52.95,50.5 C24.1 55.75,53.3 55.75,53.32 ; 51.43,50.5 51.43,47.24 B15.1 51.5,46.66 54.25,43.9 B14.1 57.04,42.13 B13.1 ; 51.43,50.5 49.75,50.5 C0.1 ; 29.52,54.83 29.52,54.06 28.25,52.79 C8.1 C9.1 24.69,46.7 24.02,46.7 ; 29.52,54.83 C4.1 32.78,54.83 34.3,56.35 34.3,57.11 ; 29.52,54.83 29.52,55.59 27.23,57.87 C7.1 ; v1(74.94,77.17) 72.15,77.17 71.39,77.93 ; 26.05,93.43 26.3,93.18 26.3,90.89 19.53,84.12 C19.1 19.02,82.09 16.48,79.55 15.68,79.55 PCA-C1.25 14.81,79.44 v1(12.02,76.65) ; 26.05,93.43 25.47,93.43 R19.1 R20.1 R21.1 R22.1 ; 26.05,93.43 A1.1 ; D13.1 33.75,29.6 34.6,30.44 ; 11.87,32.77 8.36,36.28 R17.2 8.35,37.31 8.35,44.07 ; 11.87,32.77 8.94,29.84 C34.1 6.23,25.49 ; 11.87,32.77 U4.2 ; 52,69.46 52,69.38 C17.1 ; 52,69.46 52.25,69.2 53.7,69.2 C32.1 ; 58.03,71.87 58.03,73.14 A7.1 57.3,73.86 54.07,73.86 ; 58.03,71.87 C46.2 58.03,68.78 57.52,68.28 57.52,67.29 ; 58.03,71.87 60.82,71.87 ; 79.72,9.11 80.48,9.11 84.8,13.42 84.8,17.49 86.83,19.52 ; 79.72,9.11 79.21,9.11 74.64,13.68 R3.2 70.17,12.77 R40.2 62.99,13.53 62.73,13.53 ; 79.72,9.11 79.72,8.32 R9.2 ; 57.52,67.01 59.81,67.01 C49.2 ; 57.52,67.01 57.52,67.29 ; 57.52,67.01 57.52,65.99 57.27,65.74 57.27,65.2 ; A0.1 44.08,94.2 A1.1 ; 73.55,57.37 B10.1 72.36,58.55 A11.1 69.57,64.14 A10.1 A9.1 63.22,71.76 61.95,71.76 61.84,71.87 60.82,71.87 ; 73.55,57.37 74.82,58.64 76.09,58.64 79.64,55.08 79.64,54.32 ; 48.91,79.72 A4.1 48.66,80.23 A3.1 45.1,86.32 A2.1 43.07,92.42 A1.1 ; 48.91,79.72 49.42,79.21 56.12,79.21 R16.1 ; 48.91,79.72 48.91,78.19 A5.1 45.86,76.16 43.07,76.16 A12.1 38.5,74.64 A13.1 35.7,72.86 A14.1 A15.1 32.15,63.21 ; 26.47,40.09 26.47,37.89 D15.1 27.4,35.44 30.2,32.64 27.27,29.71 27.27,28.44 26.64,27.82 ; 26.47,40.09 28,40.09 34.85,33.24 34.85,30.7 34.6,30.44 ; 26.47,40.09 C10.1 26.47,44.24 24.02,46.7 ; 55.51,8.6 53.48,6.57 D1.1 ; 55.51,8.6 55.69,8.6 USB1.0 ; 55.51,8.6 57.55,10.63 57.55,12.15 ; 26.64,27.82 27.91,26.55 27.91,22.48 27.53,22.11 27.53,20.9 ; 26.64,27.82 26.13,27.82 25.63,28.33 25.32,28.33 ; 65.62,43.14 B12.1 ; 65.62,43.14 65.62,38.88 B5.1 68.47,36.03 D9.1 66.94,32.22 ; 57.27,65.2 57.24,65.23 57.24,67.01 C52.2 57.52,67.29 ; 57.27,65.2 C39.1 ; 60.82,71.87 60.82,74.41 62.09,75.68 69.14,75.68 71.39,77.93 ; 80.59,82.7 80.02,82.14 v1(79.77,82.14) ; USB1.0 57.75,2.74 57.25,3.25 50.92,3.25 D0.1 42.7,2.25 USB3.3 v1(42.26,5.47) USB3.1 ; USB1.0 v1(58.52,7.3) ; 43.83,68.54 C51.1 ; R41.2 62.73,16.28 62.73,13.53 ; B0.1 94.46,54.91 93.44,54.91 92.43,55.93 B2.1 86.84,54.4 83.54,54.4 83.45,54.32 79.64,54.32 ; 25.32,28.33 24.61,29.04 TVS1.2 ; PCA-C1.14 9.22,72.89 v1(9.22,72.33) ; C15.1 3.53,47.88 C14.1 7.34,44.07 8.35,44.07 ; 8.35,44.07 C13.1 12.67,45.34 C12.1 16.48,45.34 20.04,48.9 20.8,48.9 23,46.7 24.02,46.7 ; 34.6,30.44 35.95,29.1 38.49,29.1 38.92,28.66 38.92,27.14 37.82,26.04 ; 55.75,53.32 X1.2 53.41,55.21 X1.4 ; 34.3,57.11 C3.1 ; R18.2 4.84,25.49 6.23,25.49 ; 79.64,54.32 79.64,51.18 B4.1 ; R27.1 18.77,6.32 R35.2 24.36,5.81 R36.2 ; 76.21,93.93 73.83,93.93 R11.2 ; 76.21,93.93 R15.1 ; 48.95,69.71 48.95,69.38 C41.1 ; 54.07,73.86 54.07,74.37 53.57,74.88 52.37,74.88 52.3,74.81 ; 57.55,12.15 60.34,12.15 61.72,13.53 62.73,13.53 ; 71.39,77.93 C18.1 ; 86.83,19.52 86.3,19.52 84.8,21.02 84.8,21.79 84.78,21.8 ; PCA-A1.25 87.14,76.35 v1(87.14,77.52)
  Bottom Layer w0.2: v1(52.87,66.41) 52.81,66.41 52.76,66.47 v1(52.76,69.46)
  Bottom Layer w0.254: 64.82,6.58 66.35,6.58 USB1.0 66.4,2.74 ; 64.82,6.58 USB1.1 ; 64.82,6.58 64.06,5.82 60.09,5.82 59.33,6.58 USB1.6 58.86,7.3 v1(58.52,7.3) ; v1(32.1,5.81) 33.12,6.83 USB3.2 33.71,6.74 34.39,6.74 ; 79.26,81.48 79.52,81.74 79.77,81.74 ; 79.26,81.48 79.01,81.48 77.23,83.26 77.23,89.87 v1(78.5,91.14) ; 79.26,81.48 v1(74.94,77.17) ; USB3.B1A12 34.39,7.05 34.39,6.74 ; v1(42.26,5.47) 41.5,6.24 ; 41.5,6.24 41.5,7.05 41.15,7.4 ; 41.5,6.24 41.5,5.98 40.23,4.71 36.17,4.71 35.66,5.22 35.15,5.22 34.39,5.98 34.39,6.74 ; v1(87.14,77.52) 86.63,77.01 85.26,77.01 80.53,81.74 79.77,81.74 ; 79.77,81.74 v1(79.77,82.14) ; v1(9.22,72.33) 9.22,74.36 11.51,76.65 v1(12.02,76.65) ; 35.91,4.97 USB3.4
  vias: v1(3.46,93.46) v1(3.46,90.46) v1(3.46,87.46) v1(3.46,84.46) v1(3.46,81.46) v1(3.46,78.46) v1(3.46,75.46) v1(3.46,72.46) v1(3.46,69.46) v1(3.46,66.46) v1(3.46,63.46) v1(3.46,60.46) v1(3.46,57.46) v1(3.46,45.46) v1(3.46,42.46) v1(3.46,39.46) v1(3.46,36.46) v1(3.46,33.46) v1(3.46,30.46) v1(3.46,24.46) v1(3.46,21.46) v1(3.46,18.46) v1(3.46,15.46) v1(3.46,12.46) v1(3.46,9.46) v1(3.46,6.46) v1(3.69,54.7) v1(3.69,48.7) v1(6.46,96.46) v1(6.46,93.46) v1(6.46,90.46) v1(6.46,78.46) v1(6.46,75.46) v1(6.46,72.46) v1(6.46,69.46) v1(6.46,66.46) v1(6.46,63.46) v1(6.46,60.46) v1(6.46,51.46) v1(6.46,48.46) v1(6.46,42.46) v1(6.46,39.46) v1(6.46,36.46) v1(6.46,33.46) v1(6.46,30.46) v1(6.46,27.46) v1(6.46,24.46) v1(6.46,18.46) v1(6.46,12.46) v1(6.46,9.46) v1(6.46,6.46) v1(6.46,3.46) v1(6.69,57.7) v1(6.69,45.7) v1(6.69,21.7) v1(9.46,96.46) v1(9.46,93.46) v1(9.46,87.46) v1(9.46,69.46) v1(9.46,66.46) v1(9.46,63.46) v1(9.46,54.46) v1(9.46,51.46) v1(9.46,48.46) v1(9.46,45.46) v1(9.46,42.46) v1(9.46,39.46) v1(9.46,33.46) v1(9.46,30.46) v1(9.46,18.46) v1(9.46,15.46) v1(9.46,12.46) v1(9.46,3.46) v1(9.69,60.7) v1(12.46,96.46) v1(12.46,93.46) v1(12.46,90.46) v1(12.46,66.46) v1(12.46,57.46) v1(12.46,54.46) v1(12.46,51.46) v1(12.46,42.46) v1(12.46,39.46) v1(12.46,36.46) v1(12.46,27.46) v1(12.46,24.46) v1(12.46,21.46) v1(12.46,18.46) v1(12.46,15.46) v1(12.46,9.46) v1(12.46,6.46) v1(12.46,3.46) v1(12.69,78.7) v1(12.69,63.7) v1(12.69,48.7) v1(12.69,45.7) v1(13.44,78.63) v1(15.46,96.46) v1(15.46,84.46) v1(15.46,42.46) v1(15.46,39.46) v1(15.46,36.46) v1(15.46,30.46) v1(15.46,27.46) v1(15.46,24.46) v1(15.46,21.46) v1(15.46,18.46) v1(15.46,15.46) v1(15.46,9.46) v1(15.46,6.46) v1(15.46,3.46) v1(18.46,96.46) v1(18.46,93.46) v1(18.46,87.46) v1(18.46,81.46) v1(18.46,78.46) v1(18.46,48.46) v1(18.46,45.46) v1(18.46,42.46) v1(18.46,39.46) v1(18.46,30.46) v1(18.46,27.46) v1(18.46,24.46) v1(18.46,18.46) v1(18.46,6.46) v1(18.46,3.46) v1(18.69,36.7) v1(18.69,9.7) v1(21.46,96.46) v1(21.46,84.46) v1(21.46,81.46) v1(21.46,78.46) v1(21.46,75.46) v1(21.46,51.46) v1(21.46,48.46) v1(21.46,45.46) v1(21.46,42.46) v1(21.46,30.46) v1(21.46,27.46) v1(21.46,24.46) v1(21.46,18.46) v1(21.46,6.46) v1(21.46,3.46) v1(21.69,93.7) v1(21.69,39.7) v1(21.69,36.7) v1(21.69,21.7) v1(21.69,15.7) v1(21.69,9.7) v1(24.46,96.46) v1(24.46,87.46) v1(24.46,84.46) v1(24.46,78.46) v1(24.46,72.46) v1(24.46,3.46) v1(24.69,93.7) v1(27.46,96.46) v1(27.46,90.46) v1(27.46,87.46) v1(27.46,81.46) v1(27.46,78.46) v1(27.46,75.46) v1(27.46,69.46) v1(27.46,51.46) v1(27.46,48.46) v1(27.46,45.46) v1(27.46,24.46) v1(27.46,9.46) v1(27.46,3.46) v1(27.69,57.7) v1(30.46,93.46) v1(30.46,90.46) v1(30.46,84.46) v1(30.46,81.46) v1(30.46,78.46) v1(30.46,75.46) v1(30.46,72.46) v1(30.46,57.46) v1(30.46,51.46) v1(30.46,48.46) v1(30.46,45.46) v1(30.46,42.46) v1(30.46,39.46) v1(30.46,9.46) v1(30.46,3.46) v1(33.46,96.46) v1(33.46,93.46) v1(33.46,87.46) v1(33.46,84.46) v1(33.46,81.46) v1(33.46,78.46) v1(33.46,75.46) v1(33.46,72.46) v1(33.46,63.46) v1(33.46,54.46) v1(33.46,51.46) v1(33.46,48.46) v1(33.46,45.46) v1(33.46,42.46) v1(33.46,33.46) v1(36.46,96.46) v1(36.46,90.46) v1(36.46,87.46) v1(36.46,84.46) v1(36.46,81.46) v1(36.46,78.46) v1(36.46,75.46) v1(36.46,36.46) v1(36.46,33.46) v1(36.46,3.46) v1(39.46,81.46) v1(39.46,78.46) v1(39.46,75.46) v1(39.69,69.7) v1(39.69,27.7) v1(39.69,21.7) v1(39.69,15.7) v1(40.23,66.37) v1(40.59,28.78) v1(40.55,16.31) v1(42.46,90.46) v1(42.46,84.46) v1(42.46,78.46) v1(42.46,51.46) v1(42.46,48.46) v1(42.69,30.7) v1(42.69,27.7) v1(42.69,21.7) v1(42.69,15.7) v1(43.59,31.78) v1(43.59,28.78) v1(43.55,16.31) v1(45.46,6.46) v1(45.46,3.46) v1(45.69,33.7) v1(45.69,30.7) v1(45.69,27.7) v1(45.69,21.7) v1(46.59,34.78) v1(46.59,31.78) v1(46.59,28.78) v1(46.55,16.31) v1(48.46,93.46) v1(48.46,87.46) v1(48.46,6.46) v1(48.46,3.46) v1(48.69,36.7) v1(48.69,33.7) v1(48.69,30.7) v1(48.69,27.7) v1(48.69,21.7) v1(48.69,15.7) v1(49.59,34.78) v1(49.59,31.78) v1(49.59,28.78) v1(49.59,25.78) v1(49.55,16.31) v1(50.94,52.35) v1(50.94,49.35) v1(51.46,9.46) v1(51.69,33.7) v1(51.69,30.7) v1(51.69,27.7) v1(51.69,15.7) v1(51.69,3.7) v1(52.59,37.78) v1(52.59,31.78) v1(52.59,28.78) v1(53.94,58.35) v1(53.94,49.35) v1(54.46,90.46) v1(54.46,87.46) v1(54.46,9.46) v1(54.46,3.46) v1(54.69,93.7) v1(54.69,30.7) v1(54.69,27.7) v1(54.69,12.7) v1(54.69,6.7) v1(55.59,40.78) v1(55.59,37.78) v1(55.59,34.78) v1(55.59,28.78) v1(56.94,55.35) v1(56.94,52.35) v1(56.94,49.35) v1(57.46,93.46) v1(57.46,87.46) v1(57.46,18.46) v1(57.46,15.46) v1(57.46,9.46) v1(57.69,90.7) v1(57.69,27.7) v1(57.69,12.7) v1(58.3,73.06) v1(58.59,40.78) v1(58.59,37.78) v1(58.59,34.78) v1(58.59,31.78) v1(59.38,70.91) v1(59.94,61.35) v1(59.94,58.35) v1(59.94,55.35) v1(59.94,52.35) v1(59.94,49.35) v1(60.46,96.46) v1(60.46,93.46) v1(60.46,90.46) v1(60.46,21.46) v1(60.46,18.46) v1(60.46,3.46) v1(60.69,87.7) v1(61.3,70.06) v1(61.59,37.78) v1(61.59,34.78) v1(61.59,31.78) v1(62.94,52.35) v1(63.46,96.46) v1(63.46,93.46) v1(63.46,90.46) v1(63.46,87.46) v1(63.46,45.46) v1(63.46,18.46) v1(63.46,3.46) v1(63.69,42.7) v1(63.69,21.7) v1(64.3,73.06) v1(64.3,70.06) v1(64.59,34.78) v1(64.59,31.78) v1(65.38,64.91) v1(66.46,96.46) v1(66.46,93.46) v1(66.46,90.46) v1(66.46,87.46) v1(66.46,48.46) v1(66.46,24.46) v1(66.46,21.46) v1(66.46,18.46) v1(66.46,15.46) v1(66.46,12.46) v1(66.46,9.46) v1(66.69,39.7) v1(67.3,73.06) v1(67.3,67.06) v1(67.59,31.78) v1(68.38,61.91) v1(68.38,58.91) v1(69.46,96.46) v1(69.46,93.46) v1(69.46,87.46) v1(69.46,51.46) v1(69.46,48.46) v1(69.46,42.46) v1(69.46,39.46) v1(69.46,27.46) v1(69.46,24.46) v1(69.46,21.46) v1(69.46,18.46) v1(69.46,15.46) v1(69.46,12.46) v1(69.46,9.46) v1(69.46,6.46) v1(69.46,3.46) v1(69.69,90.7) v1(69.69,78.7) v1(70.3,73.06) v1(70.3,70.06) v1(72.46,96.46) v1(72.46,93.46) v1(72.46,90.46) v1(72.46,87.46) v1(72.46,54.46) v1(72.46,51.46) v1(72.46,48.46) v1(72.46,39.46) v1(72.46,36.46) v1(72.46,21.46) v1(72.46,18.46) v1(72.46,15.46) v1(72.46,12.46) v1(72.46,9.46) v1(72.46,6.46) v1(72.46,3.46) v1(73.3,73.06) v1(74.38,76.91) v1(75.46,96.46) v1(75.46,90.46) v1(75.46,87.46) v1(75.46,33.46) v1(75.46,18.46) v1(75.46,15.46) v1(75.46,12.46) v1(75.46,9.46) v1(75.46,6.46) v1(75.46,3.46) v1(75.69,63.7) v1(75.69,48.7) v1(75.69,36.7) v1(77.38,76.91) v1(78.46,96.46) v1(78.46,93.46) v1(78.46,87.46) v1(78.46,60.46) v1(78.46,15.46) v1(78.46,12.46) v1(78.46,9.46) v1(78.46,6.46) v1(78.46,3.46) v1(78.69,66.7) v1(81.46,96.46) v1(81.46,90.46) v1(81.46,63.46) v1(81.46,60.46) v1(81.46,57.46) v1(81.46,51.46) v1(81.46,18.46) v1(81.46,15.46) v1(81.46,9.46) v1(81.46,6.46) v1(81.46,3.46) v1(81.69,69.7) v1(81.69,12.7) v1(82.78,26.07) v1(84.46,96.46) v1(84.46,90.46) v1(84.46,87.46) v1(84.46,66.46) v1(84.46,63.46) v1(84.46,60.46) v1(84.46,57.46) v1(84.46,48.46) v1(84.46,42.46) v1(84.46,39.46) v1(84.46,36.46) v1(84.46,33.46) v1(84.46,18.46) v1(84.46,15.46) v1(84.46,12.46) v1(84.46,9.46) v1(84.46,6.46) v1(84.46,3.46) v1(84.69,93.7) v1(84.69,72.7) v1(84.69,54.7) v1(84.69,24.7) v1(87.46,96.46) v1(87.46,93.46) v1(87.46,87.46) v1(87.46,69.46) v1(87.46,66.46) v1(87.46,63.46) v1(87.46,60.46) v1(87.46,57.46) v1(87.46,51.46) v1(87.46,15.46) v1(87.46,12.46) v1(87.46,9.46) v1(87.46,6.46) v1(87.46,3.46) v1(87.69,54.7) v1(90.46,96.46) v1(90.46,90.46) v1(90.46,87.46) v1(90.46,84.46) v1(90.46,78.46) v1(90.46,75.46) v1(90.46,72.46) v1(90.46,69.46) v1(90.46,66.46) v1(90.46,63.46) v1(90.46,60.46) v1(90.46,57.46) v1(90.46,54.46) v1(90.46,51.46) v1(90.46,48.46) v1(90.46,45.46) v1(90.46,42.46) v1(90.46,39.46) v1(90.46,30.46) v1(90.46,24.46) v1(90.46,18.46) v1(90.46,12.46) v1(90.46,9.46) v1(90.46,6.46) v1(90.46,3.46) v1(90.69,81.7) v1(93.46,96.46) v1(93.46,93.46) v1(93.46,90.46) v1(93.46,87.46) v1(93.46,81.46) v1(93.46,78.46) v1(93.46,75.46) v1(93.46,72.46) v1(93.46,69.46) v1(93.46,66.46) v1(93.46,63.46) v1(93.46,60.46) v1(93.46,57.46) v1(93.46,48.46) v1(93.46,45.46) v1(93.46,42.46) v1(93.46,33.46) v1(93.46,24.46) v1(93.46,21.46) v1(93.46,15.46) v1(93.46,9.46) v1(93.46,6.46) v1(93.46,3.46) v1(93.69,84.7) v1(93.69,51.7) v1(96.46,93.46) v1(96.46,90.46) v1(96.46,87.46) v1(96.46,84.46) v1(96.46,81.46) v1(96.46,78.46) v1(96.46,75.46) v1(96.46,72.46) v1(96.46,69.46) v1(96.46,66.46) v1(96.46,63.46) v1(96.46,60.46) v1(96.46,57.46) v1(96.46,54.46) v1(96.46,48.46) v1(96.46,45.46) v1(96.46,39.46) v1(96.46,36.46) v1(96.46,33.46) v1(96.46,30.46) v1(96.46,27.46) v1(96.46,24.46) v1(96.46,21.46) v1(96.46,18.46) v1(96.46,15.46) v1(96.46,12.46) v1(96.46,9.46) v1(96.46,6.46)
DN: length 83.5
  Top Layer w0.254: TVS1.6 TVS1.1 23.66,29.04 v1(24.42,28.28) ; v1(36.36,5.37) 35.85,4.86 33.06,4.86 v1(32.8,5.12) ; v1(36.5,62.45) R43.1
  Bottom Layer w0.254: v1(36.5,62.45) 36.5,43.15 24.17,30.82 24.17,28.53 v1(24.42,28.28) 23.91,27.77 23.91,7.66 26.45,5.12 v1(32.8,5.12) ; v1(36.36,5.37) 37.63,6.64 ; 37.63,6.64 37.88,6.39 38.39,6.39 38.69,6.69 USB3.B7 ; 37.63,6.64 37.63,7.34 USB3.A7
DP: length 80
  Top Layer w0.254: TVS1.4 TVS1.3 v1(26.32,28.53) ; R44.1 38.64,68.78 35.75,65.9 35.75,62.34 39.78,58.31 39.78,54.69 v1(39.02,53.93)
  Bottom Layer w0.254: 37.19,8.42 37.24,8.47 37.24,17.61 v1(26.32,28.53) 39.02,41.23 v1(39.02,53.93) ; 37.19,8.42 USB3.B6 ; 37.19,8.42 37.96,8.42 38.21,8.16 38.21,7.42 USB3.A6
GPIO1: length 32.4
  Top Layer w0.2: U5.3 47.39,65.7 v1(47.93,66.24)
  Bottom Layer w0.2: NOREF#11.1 45.39,94.95 45.39,68.78 v1(47.93,66.24)
LDR_ADC: length 82.9
  Top Layer w0.2: v1(52.78,64.91) U5.41
  Top Layer w0.254: v1(41.59,57.35) 40.83,58.12 40.83,63.91 C47.1 ; 69.58,13.68 62.68,20.58 v1(62.68,24.33) ; v1(47.69,39.32) 45.4,41.61 v1(45.4,43.13) 45.91,43.64 LDR1.2
  Bottom Layer w0.2: v1(41.59,57.35) 50.56,57.35 52.09,58.88 52.09,64.21 v1(52.78,64.91)
  Bottom Layer w0.254: v1(41.59,57.35) 41.59,57.1 45.4,53.29 v1(45.4,43.13) ; v1(47.69,39.32) v1(62.68,24.33)
PWR_SW_CTRL: length 10.3
  Top Layer w0.2: R32.2 61.15,61.67 v1(58.35,64.47) ; v1(55.27,64.5) U5.40
  Bottom Layer w0.2: v1(58.35,64.47) 55.31,64.47 v1(55.27,64.5)
QSPI_SS: length 12.3
  Top Layer w0.254: v1(39.3,89.61) 39.3,85.56 R46.2
  Bottom Layer w0.254: NOREF#10.10 43.87,94.19 v1(39.3,89.61)
RUN: length 43.5
  Top Layer w0.2: U5.26 51.67,60.64 52.2,61.16 v1(52.76,61.16)
  Bottom Layer w0.2: NOREF#9.5 55.3,97.23 53.52,97.23 52.5,96.22 52.5,95.2 51.74,94.44 51.74,69.55 52.25,69.04 52.25,66.24 53.52,64.97 53.52,64.72 52.5,63.7 52.5,61.42 v1(52.76,61.16)
SCL: length 229.1
  Top Layer w0.2: v1(37.33,42.84) 37.33,31.22 R23.2 ; v1(14.05,79.58) 14.3,79.58 14.81,80.09 PCA-C1.26 ; v1(45.71,62.91) U5.10 ; v1(85.08,74.84) 87.04,74.84 87.73,75.54 87.73,76.3
  Top Layer w0.254: 85.44,21.8 85.44,22.93 v1(86.2,23.69) ; 26.88,20.9 26.79,21 26.79,21.76 26.28,22.27 v1(25.77,22.27)
  Bottom Layer w0.2: v1(14.05,79.58) 21.16,79.58 37.84,62.91 38.09,62.91 ; 37.33,55.03 v1(37.33,42.84) ; 37.33,55.03 38.85,55.03 41.14,52.74 41.14,46.39 45.2,42.33 45.46,42.33 77.97,74.84 82.29,74.84 82.8,74.33 84.57,74.33 v1(85.08,74.84) ; 37.33,55.03 37.33,56.3 38.09,57.06 38.09,62.91 ; 38.09,62.91 v1(45.71,62.91)
  Bottom Layer w0.254: v1(37.33,42.84) 25.65,31.16 25.65,22.39 v1(25.77,22.27) ; 68.57,65.44 70.1,65.44 87.97,47.57 87.97,25.47 v1(86.2,23.69)
SDA: length 208.8
  Top Layer w0.2: v1(45.8,63.72) 46.22,63.3 U5.9 ; v1(48.08,58.64) 47.32,58.64 46.31,57.63 46.31,55.09 48.85,52.55 48.85,44.42 50.37,42.9 50.37,42.64 R24.2 ; v1(14.3,80.49) 14.56,80.74 PCA-C1.27 ; PCA-A1.27 88.22,76.13 88.22,75.41 73.99,61.18 v1(73.48,61.18)
  Top Layer w0.254: 86.09,21.8 86.18,21.7 v1(86.18,20.54) ; v1(35.64,21.56) 35.64,20.29 33.61,18.26 v1(28.88,18.26) ; v1(26.59,19.53) 26.23,19.88 26.23,20.9 ; 50.37,42.64 v1(48.34,40.61)
  Bottom Layer w0.2: 50.62,38.32 v1(73.48,61.18) ; v1(48.08,58.64) 48.08,61.44 v1(45.8,63.72) 45.54,63.47 41.23,63.47 24.21,80.49 v1(14.3,80.49)
  Bottom Layer w0.254: v1(86.18,20.54) 80.6,20.54 79.83,19.78 78.31,19.78 72.98,25.12 63.83,25.12 v1(48.34,40.61) 48.08,40.61 37.42,29.94 37.42,23.34 v1(35.64,21.56) ; v1(26.59,19.53) 27.86,18.26 v1(28.88,18.26)
SWCLK: length 38.9
  Top Layer w0.2: U5.24 50.87,59.37 v1(50.75,59.24)
  Bottom Layer w0.2: NOREF#7.7 50.87,94.04 50.87,69.15 51.38,68.64 51.38,68.38 50.87,67.88 50.87,59.37 v1(50.75,59.24)
SWD: length 38.4
  Top Layer w0.2: v1(51.53,59.11) 51.53,59.37 51.27,59.62 U5.25
  Bottom Layer w0.2: NOREF#5.6 51.27,95.75 51.27,69.33 51.78,68.82 51.78,68.06 51.53,67.81 v1(51.53,59.11)
XIN: length 15.8
  Top Layer w0.2: X1.1 51.24,54.8 47.13,54.8 46.88,55.05 46.88,57.59 47.13,57.84 48.15,57.84 49.67,59.37 U5.21
  Top Layer w0.254: C24.2 51.66,52.93 X1.1
XOUT: length 46
  Top Layer w0.2: v1(49.46,61.16) 49.54,61.16 50.07,60.64 U5.22 50.07,59.23 48.04,57.2 47.79,57.2 R45.2
  Bottom Layer w0.2: NOREF.3 38.53,93.17 38.53,74.63 49.46,63.7 v1(49.46,61.16)
$1N2211: length 9.6
  Top Layer w0.254: Q1.1 65.9,56.65 R31.1 R32.1
$1N2238: length 17.8
  Top Layer w0.254: v1(39.26,6.45) 37.42,6.45 v1(35.28,8.59) ; R35.1 24.61,7.83 v1(24.86,7.57)
  Bottom Layer w0.254: v1(39.26,6.45) 39.26,7.34 USB3.A5 ; v1(35.28,8.59) 25.88,8.59 v1(24.86,7.57)
$1N2239: length 10
  Top Layer w0.254: v1(35.7,5.88) 35.19,5.37 33.41,5.37 31.47,7.32 R36.1
  Bottom Layer w0.254: USB3.B5 36.19,6.37 v1(35.7,5.88)
$1N2269: length 6.1
  Top Layer w0.254: v1(62.5,12.01) 62.25,12.26 R40.1
  Bottom Layer w0.254: USB1.3 62.5,6.91 v1(62.5,12.01)
$1N2270: length 10.3
  Top Layer w0.254: R41.1 61.91,16.46 v1(61.66,16.21)
  Bottom Layer w0.254: v1(61.66,16.21) 61.66,6.92 USB1.4
$1N2837: length 19.7
  Top Layer w0.2: R43.2 v1(38.79,67.51) ; v1(48.25,63.95) 48.25,65.28 49.52,66.55 51.07,66.55 51.27,66.74 U5.51
  Bottom Layer w0.2: v1(48.25,63.95) 47.49,64.71 45.71,64.71 42.92,67.51 v1(38.79,67.51)
$1N2842: length 12.6
  Top Layer w0.2: v1(50.62,68.53) 50.87,68.28 U5.52 ; R44.2 41.07,69.29 45.89,69.29 v1(46.15,69.04)
  Bottom Layer w0.2: v1(50.62,68.53) 49.86,67.77 47.42,67.77 v1(46.15,69.04)
$1N3610: length 8.7
  Top Layer w0.2: v1(55.54,69.55) 56.3,70.31 56.38,70.31 ; U5.46 53.29,67.26 v1(53.76,67.26)
  Top Layer w0.254: R42.1 55.36,72.27 55.36,71.32 C46.1
  Bottom Layer w0.2: v1(55.54,69.55) 55.28,69.55 53.76,68.02 v1(53.76,67.26)
$1N8250: length 11.8
  Top Layer w0.254: C33.1 56.63,54.19 X1.3 52.95,57.87 49.96,57.87 R45.1
$1N8339: length 12.4
  Top Layer w0.2: L1.1 61.14,66.99 v1(60.89,67.24) ; U5.48 52.5,67.31 52.5,68.01 52.53,68.03 54,68.03 54.79,67.24 v1(55.81,67.24)
  Bottom Layer w0.2: v1(60.89,67.24) v1(55.81,67.24)
$1N8471: length 23.7
  Top Layer w0.2: v1(47.67,77.95) 45.38,77.95 R46.1 ; U5.60 v1(47.67,68.55)
  Bottom Layer w0.2: v1(47.67,68.55) v1(47.67,77.95)
$2N3702: length 44.4
  Top Layer w0.254: v1(84.13,84.04) 84.64,84.04 85.15,83.53 85.15,82.71 85.13,82.7 ; A1.2 55.17,84.54 79.05,84.54 v1(79.56,84.04)
  Bottom Layer w0.254: v1(84.13,84.04) 83.37,83.27 80.32,83.27 v1(79.56,84.04)
$2N3703: length 43.2
  Top Layer w0.254: v1(78.54,83.02) 77.27,83.02 76.76,83.53 50.09,83.53 A2.2 ; v1(82.86,81.24) 83.79,81.24 84.48,81.94 84.48,82.7
  Bottom Layer w0.254: v1(82.86,81.24) 81.34,82.77 78.8,82.77 v1(78.54,83.02)
$2N3704: length 39.5
  Top Layer w0.254: A3.2 48.38,82.7 v1(56.26,82.7) ; 83.84,82.7 83.84,83.46 82.06,85.24 v1(63.88,85.24)
  Bottom Layer w0.254: v1(63.88,85.24) 61.34,82.7 v1(56.26,82.7)
$2N3705: length 43.9
  Top Layer w0.254: A5.2 48.57,75.91 v1(50.09,77.43) ; v1(81.4,84.09) 81.91,84.09 82.42,83.58 82.42,82.82 82.53,82.7 ; v1(77.85,83.72) 77.59,83.97 50.67,83.97 v1(50.16,84.48)
  Bottom Layer w0.254: v1(50.16,84.48) 50.09,84.41 v1(50.09,77.43) ; v1(77.85,83.72) 78.86,84.73 80.76,84.73 v1(81.4,84.09)
$2N3706: length 32.4
  Top Layer w0.254: A6.2 53.57,78.28 65.5,78.28 v1(66.77,79.55) ; 81.88,82.7 81.78,82.6 81.78,81.83 80.77,80.82 v1(68.04,80.82)
  Bottom Layer w0.254: v1(66.77,79.55) v1(68.04,80.82)
$2N3707: length 27.1
  Top Layer w0.254: v1(64.74,80.06) 66.13,81.45 80.74,81.45 81.23,81.94 81.23,82.7 ; A7.2 v1(60.68,75.99)
  Bottom Layer w0.254: v1(60.68,75.99) v1(64.74,80.06)
$2N3708: length 35.2
  Top Layer w0.254: A4.2 52.89,82 78.42,82 81.15,84.73 81.91,84.73 83.19,83.46 83.19,82.7
$2N3710: length 42.9
  Top Layer w0.254: 85.78,82.7 85.78,83.65 84.64,84.8 83.11,84.8 81.84,86.07 61.02,86.07 A0.2
$2N3711: length 27.3
  Top Layer w0.254: B0.2 97.45,49.61 97.45,42.93 83.48,28.96 83.48,28.2
$2N3713: length 21.2
  Top Layer w0.254: 80.88,28.2 80.88,47.74 79.73,48.9
$2N3714: length 15.9
  Top Layer w0.254: B7.2 78.94,39.19 78.94,28.2
$2N3715: length 15.6
  Top Layer w0.254: B6.2 77.6,33.93 77.6,27.39 78.1,26.89 79.03,26.89 79.59,27.44 79.59,28.2
$2N3716: length 19.3
  Top Layer w0.254: 80.23,28.2 80.23,27.44 79.18,26.38 78.03,26.38 77.02,27.39 77.02,29.68 B5.2
$2N3717: length 24.8
  Top Layer w0.254: 81.53,28.2 81.53,50.2 B3.2
$2N3718: length 28.1
  Top Layer w0.254: B2.2 82.19,47.55 82.19,28.2
$2N3719: length 28.9
  Top Layer w0.254: B1.2 82.84,42.1 82.84,28.2
$2N3720: length 44.7
  Top Layer w0.254: v1(34.83,55.65) 37.14,53.33 C1.2 ; 9.17,77.49 9.93,77.49 14.25,73.17 14.25,72.67 21.11,65.81 v1(23.9,65.81)
  Bottom Layer w0.254: v1(34.83,55.65) 24.67,65.81 v1(23.9,65.81)
$2N3721: length 38.6
  Top Layer w0.254: v1(30.25,62.36) 28.22,64.4 21.87,64.4 13.74,72.52 13.74,73.03 9.93,76.84 PCA-C1.8 ; v1(35.84,58.3) 36.76,58.3 C2.2
  Bottom Layer w0.254: v1(35.84,58.3) 31.78,62.36 v1(30.25,62.36)
$2N3722: length 32.6
  Top Layer w0.254: C3.2 31.61,58.92 26.95,58.92 v1(23.9,61.97) ; 9.17,76.19 9.93,76.19 13.24,72.89 13.24,72.38 22.38,63.24 v1(22.89,63.24)
  Bottom Layer w0.254: v1(23.9,61.97) 22.89,62.98 v1(22.89,63.24)
$2N3723: length 29.2
  Top Layer w0.254: v1(10.44,74.64) 10.19,74.89 PCA-C1.11 ; v1(24.02,69.3) 24.27,69.3 31.38,62.19 C5.2
  Bottom Layer w0.254: v1(24.02,69.3) 16.91,76.42 14,76.42 12.22,74.64 v1(10.44,74.64)
$2N3724: length 23.5
  Top Layer w0.254: PCA-C1.12 9.93,74.24 21.62,62.56 26.42,62.56 C6.2
$2N3725: length 22.5
  Top Layer w0.254: C7.2 24.41,57.99 24.41,59.11 9.93,73.59 PCA-C1.13
$2N3726: length 32
  Top Layer w0.254: PCA-C1.10 8.41,75.54 7.9,75.03 7.9,72.75 19.33,61.32 19.59,61.32 23.65,57.25 23.65,57 25.82,54.83 C4.2
$2N3728: length 53
  Top Layer w0.254: C0.2 46.92,50.37 44.8,52.49 44.8,53.76 44.29,54.27 41.24,54.27 40.23,55.28 40.23,59.6 v1(37.43,62.39) ; PCA-C1.6 10.95,78.14 v1(11.71,77.38)
  Bottom Layer w0.254: v1(37.43,62.39) 22.45,77.38 v1(11.71,77.38)
$2N3742: length 13.6
  Top Layer w0.254: R9.1 83.48,13.51 83.48,21.8
$2N3743: length 13.2
  Top Layer w0.254: R2.2 95,36.33 93.2,36.33 86.09,29.22 86.09,28.2
$2N3744: length 13.1
  Top Layer w0.254: 85.44,28.2 85.44,27.44 85.94,26.93 89.67,26.93 R6.2
$2N3745: length 12.6
  Top Layer w0.254: 84.78,28.2 84.78,27.44 85.8,26.42 92.97,26.42 R7.2
$2N3746: length 12.2
  Top Layer w0.254: R8.2 85.71,25.86 84.13,27.44 84.13,28.2
$2N3747: length 13.3
  Top Layer w0.254: v1(86.68,18.24) 88.36,18.24 R4.1 ; v1(85.66,19.26) 84.13,20.78 84.13,21.8
  Bottom Layer w0.254: v1(85.66,19.26) v1(86.68,18.24)
$2N3748: length 15.6
  Top Layer w0.254: R28.1 89.75,79.86 v1(87.31,79.86) ; PCA-A1.23 85.78,77.57 v1(85.53,77.82)
  Bottom Layer w0.254: v1(87.31,79.86) 85.53,78.08 v1(85.53,77.82)
$2N3749: length 29.4
  Top Layer w0.254: R11.1 69.13,89 77.29,89 v1(78.05,89.76) ; PCA-A1.24 v1(86.44,77.82)
  Bottom Layer w0.254: v1(78.05,89.76) 79.32,89.76 87.96,81.13 87.96,79.35 v1(86.44,77.82)
$2N3750: length 10.3
  Top Layer w0.254: 89.04,82.7 89.04,91.36 R12.2
$2N3751: length 11
  Top Layer w0.254: R13.2 88.39,89.71 88.39,82.7
$2N3752: length 12.6
  Top Layer w0.254: R14.2 87.73,85.78 87.73,82.7
$2N3753: length 15.4
  Top Layer w0.254: 87.09,82.7 87.09,83.46 85.34,85.2 83.49,85.2 R15.2
$2N3754: length 31.1
  Top Layer w0.254: R16.2 64.49,78.96 65.68,80.16 84.73,80.16 86.44,81.86 86.44,82.7
$2N3755: length 46.6
  Top Layer w0.254: v1(18.11,73.99) 18.37,74.24 18.37,76.78 16.36,78.79 PCA-C1.24 ; v1(15.57,44.27) 9.87,38.57 R17.1
  Bottom Layer w0.254: v1(18.11,73.99) 17.49,73.36 17.49,46.19 v1(15.57,44.27)
$2N3757: length 60.3
  Top Layer w0.254: PCA-C1.23 14.81,78.14 13.21,76.54 13.21,75.27 v1(13.46,75.02) ; v1(13.72,65.87) 1.52,53.68 1.52,30.31 R18.1
  Bottom Layer w0.254: v1(13.72,65.87) 13.46,66.13 v1(13.46,75.02)
$2N3758: length 20.6
  Top Layer w0.254: PCA-C1.1 18.82,91.04 24.59,91.04 R19.2
$2N3759: length 19.7
  Top Layer w0.254: R20.2 20.75,91.78 18.06,91.78 7.9,81.62 7.9,80.6 8.41,80.09 PCA-C1.3
$2N3760: length 17.3
  Top Layer w0.254: PCA-C1.4 8.41,79.44 7.39,80.46 7.39,82.99 R21.2
$2N3761: length 16.3
  Top Layer w0.254: PCA-C1.5 8.41,78.79 6.91,80.29 6.91,87.59 R22.2
$2N3763: length 13.4
  Top Layer w0.254: PCA-D1.5 28.12,14.43 28.12,13.67 23.54,9.1 R27.2
$2N3764: length 21.2
  Top Layer w0.254: PCA-D1.4 27.53,13.72 27.04,13.23 13.83,13.23 R26.2
$2N3767: length 8.6
  Top Layer w0.254: R30.1 23.79,25.86 v1(27.1,22.56) ; 28.84,20.9 28.84,22.09 v1(28.62,22.3)
  Bottom Layer w0.254: v1(27.1,22.56) 28.37,22.56 v1(28.62,22.3)
$2N3768: length 19.6
  Top Layer w0.254: v1(27.07,18) 27.68,17.4 v1(31.49,17.4) ; R29.1 22.5,14.96 v1(25.54,18) ; v1(29.71,19.38) 29.45,19.63 28.69,19.63 28.19,20.14 28.19,20.9
  Bottom Layer w0.254: v1(29.71,19.38) 31.49,17.6 v1(31.49,17.4) ; v1(25.54,18) v1(27.07,18)
$2N3773: length 29.7
  Top Layer w0.254: PCA-D1.6 28.84,13.74 41.34,1.23 51.11,1.23 D0.2
$2N3774: length 22.3
  Top Layer w0.254: PCA-D1.10 31.44,15.26 34.99,18.82 50.15,18.82 D4.2
$2N3775: length 35.6
  Top Layer w0.254: D7.2 63.05,27.15 53.7,17.8 35.93,17.8 33.38,15.26 PCA-D1.13
$2N3776: length 30.7
  Top Layer w0.254: D6.2 51.42,18.31 35.78,18.31 32.73,15.26 32.73,14.5
$2N3777: length 25.8
  Top Layer w0.254: D5.2 52.3,22.52 51.39,21.61 v1(50.63,21.61) ; v1(43.01,13.99) 42.25,13.23 32.59,13.23 32.09,13.74 PCA-D1.11
  Bottom Layer w0.254: v1(43.01,13.99) v1(50.63,21.61)
$2N3778: length 26.9
  Top Layer w0.254: PCA-D1.9 30.78,13.74 31.8,12.72 51.17,12.72 D3.2
$2N3779: length 29.1
  Top Layer w0.254: D2.2 55.74,10.44 33.44,10.44 30.13,13.74 PCA-D1.8
$2N3780: length 30.8
  Top Layer w0.254: PCA-D1.7 29.48,13.74 33.8,9.42 48.79,9.42 52.85,5.36 54.73,5.36 D1.2
$2N3781: length 22.9
  Top Layer w0.254: v1(26.98,15.76) 26.98,14.6 PCA-D1.3 ; R25.2 7.43,14.24 24.44,14.24 v1(24.7,14.49)
  Bottom Layer w0.254: v1(24.7,14.49) 25.71,14.49 v1(26.98,15.76)
$2N3782: length 61.5
  Top Layer w0.254: v1(83.51,77.82) 84.37,77.82 85.13,77.06 PCA-A1.22 ; v1(70.04,77.57) 56.58,77.57 55.17,76.16 50.6,76.16 49.33,74.89 v1(49.33,74.13) ; A15.2 34.6,66.26 40.7,72.35 48.06,72.35 v1(48.32,72.61)
  Bottom Layer w0.254: v1(48.32,72.61) 48.32,73.11 v1(49.33,74.13) ; v1(83.51,77.82) 81.98,76.3 71.31,76.3 v1(70.04,77.57)
$2N3783: length 60.1
  Top Layer w0.254: v1(81.84,73.88) 74.73,66.76 68.89,66.76 68.64,67.02 68.64,68.03 66.35,70.32 65.33,70.32 62.79,72.86 v1(61.78,72.86) ; v1(53.4,74.13) 52.63,73.37 47.05,73.37 46.54,72.86 40.44,72.86 37.39,69.81 A14.2 ; PCA-A1.21 84.38,76.2 84.38,74.64 83.37,73.62 v1(83.11,73.62)
  Bottom Layer w0.254: v1(83.11,73.62) 82.86,73.88 v1(81.84,73.88) ; v1(61.78,72.86) 60.51,74.13 v1(53.4,74.13)
$2N3784: length 53.4
  Top Layer w0.254: PCA-A1.20 83.76,76.23 v1(83.76,75.03) ; A13.2 39.43,73.37 42.22,73.37 42.47,73.62 42.47,74.89 43.24,75.65 44.76,75.65 45.78,74.64 47.05,74.64 47.55,75.15 47.55,76.16 49.47,78.08 v1(52.52,78.08)
  Bottom Layer w0.254: v1(83.76,75.03) 83.76,75.28 83.25,75.79 65.73,75.79 64.46,77.06 63.44,77.06 61.66,75.28 55.31,75.28 v1(52.52,78.08)
$2N3785: length 42.8
  Top Layer w0.254: A12.2 44.25,74.13 48.06,74.13 v1(48.32,74.38) ; v1(50.09,74.64) 51.11,75.65 55.43,75.65 56.58,76.81 63.19,76.81 v1(63.69,76.3) ; PCA-A1.19 83.19,75.28 v1(83,75.1)
  Bottom Layer w0.254: v1(63.69,76.3) 64.64,75.35 82.74,75.35 v1(83,75.1) ; v1(50.09,74.64) 49.84,74.89 48.82,74.89 v1(48.32,74.38)
$2N3786: length 17.2
  Top Layer w0.254: PCA-A1.18 82.53,75.5 82.28,75.24 82.28,74.99 82.52,74.75 82.52,73.71 A11.2
$2N3787: length 16.5
  Top Layer w0.254: PCA-A1.17 81.88,75.36 74.14,67.61 69.57,67.61
$2N3788: length 17.8
  Top Layer w0.254: 81.23,76.3 81.23,75.54 76.86,71.17 66.01,71.17
$2N3789: length 19.6
  Top Layer w0.254: PCA-A1.15 78.25,73.96 A8.2
$2N3790: length 40.5
  Top Layer w0.254: v1(78.29,25.58) 79.82,25.58 82.84,22.56 82.84,21.8 ; B15.2 57.47,47.17 v1(58.99,45.64)
  Bottom Layer w0.254: v1(58.99,45.64) 58.99,44.88 v1(78.29,25.58)
$2N3791: length 40
  Top Layer w0.254: 82.19,21.8 82.19,21.04 80.41,19.27 78.54,19.27 70.41,27.39 v1(70.41,32.47) ; B14.2 60,43.9 61.27,42.63 61.27,41.62 v1(67.87,35.01)
  Bottom Layer w0.254: v1(67.87,35.01) v1(70.41,32.47)
$2N3792: length 40.6
  Top Layer w0.254: 81.53,21.8 81.53,22.88 v1(81.34,23.08) ; B13.2 v1(65.59,45.43)
  Bottom Layer w0.254: v1(65.59,45.43) 75.24,45.43 81.34,39.33 v1(81.34,23.08)
$2N3793: length 32.2
  Top Layer w0.254: 80.88,21.8 80.83,21.74 80.83,20.54 80.07,19.77 78.8,19.77 75.49,23.08 75.49,30.44 71.18,34.76 70.41,34.76 67.37,37.81 B12.2
$2N3794: length 29.1
  Top Layer w0.254: v1(80.22,23.28) 80.22,21.81 80.23,21.8 ; B11.2 v1(72.6,44.62)
  Bottom Layer w0.254: v1(72.6,44.62) 75.39,44.62 80.22,39.79 v1(80.22,23.28)
$2N3795: length 40.1
  Top Layer w0.254: v1(79.56,20.53) 79.56,21.78 79.59,21.8 ; B10.2 78.8,54.32 78.8,48.22 79.59,47.43 v1(79.59,29.65)
  Bottom Layer w0.254: v1(79.59,29.65) 79.59,20.55 v1(79.56,20.53)
$2N3796: length 31.7
  Top Layer w0.254: v1(78.94,40.21) 78.29,40.86 78.29,50.76 B9.2 ; v1(78.94,23.95) 78.94,21.8
  Bottom Layer w0.254: v1(78.94,40.21) v1(78.94,23.95)
$2N3797: length 29.3
  Top Layer w0.254: 78.28,21.8 76.26,23.83 v1(76.26,29.43) ; B8.2 74.48,45.43 74.48,40.6 v1(77.78,37.3)
  Bottom Layer w0.254: v1(77.78,37.3) 77.78,30.95 v1(76.26,29.43)
$2N3798: length 35.4
  Top Layer w0.254: v1(17.75,74.72) 17.75,76.07 16.33,77.49 15.57,77.49 ; v1(13.69,61.51) 2.51,50.34 C15.2
  Bottom Layer w0.254: v1(17.75,74.72) 15.97,72.94 15.97,63.29 14.2,61.51 v1(13.69,61.51)
$2N3799: length 34.8
  Top Layer w0.254: v1(14.45,64.31) 14.45,54.91 C14.2 ; PCA-C1.21 15.55,76.86 14.79,76.86 14.03,76.1 v1(14.03,75.59)
  Bottom Layer w0.254: v1(14.45,64.31) 14.96,64.82 14.96,74.66 v1(14.03,75.59)
$2N3800: length 33.4
  Top Layer w0.254: 11.4,46.27 15.21,50.08 v1(15.21,63.55) ; v1(16.99,75.23) 16.99,75.74 16.54,76.19 15.57,76.19
  Bottom Layer w0.254: v1(15.21,63.55) 15.47,63.8 15.47,73.71 v1(16.99,75.23)
$2N3801: length 30
  Top Layer w0.254: C12.2 16.23,63.46 v1(14.3,65.38) ; PCA-C1.19 14.81,75.54 14.3,75.03 14.3,74.53 v1(14.05,74.27)
  Bottom Layer w0.254: v1(14.3,65.38) 14.3,74.02 v1(14.05,74.27)
$2N3802: length 26.1
  Top Layer w0.254: v1(20.04,60.01) C11.2 ; v1(20.04,67.89) 20.04,71.19 16.33,74.89 PCA-C1.18
  Bottom Layer w0.254: v1(20.04,67.89) v1(20.04,60.01)
$2N3803: length 35.7
  Top Layer w0.254: PCA-C1.17 16.33,74.24 19.38,71.19 v1(19.38,70.94) ; v1(23.95,45.79) 23.95,42.95 C10.2
  Bottom Layer w0.254: v1(23.95,45.79) 22.18,47.57 22.18,68.15 v1(19.38,70.94)
